# EAGLE board RBCX (EAGLE 9.6.2), part 1 of 3
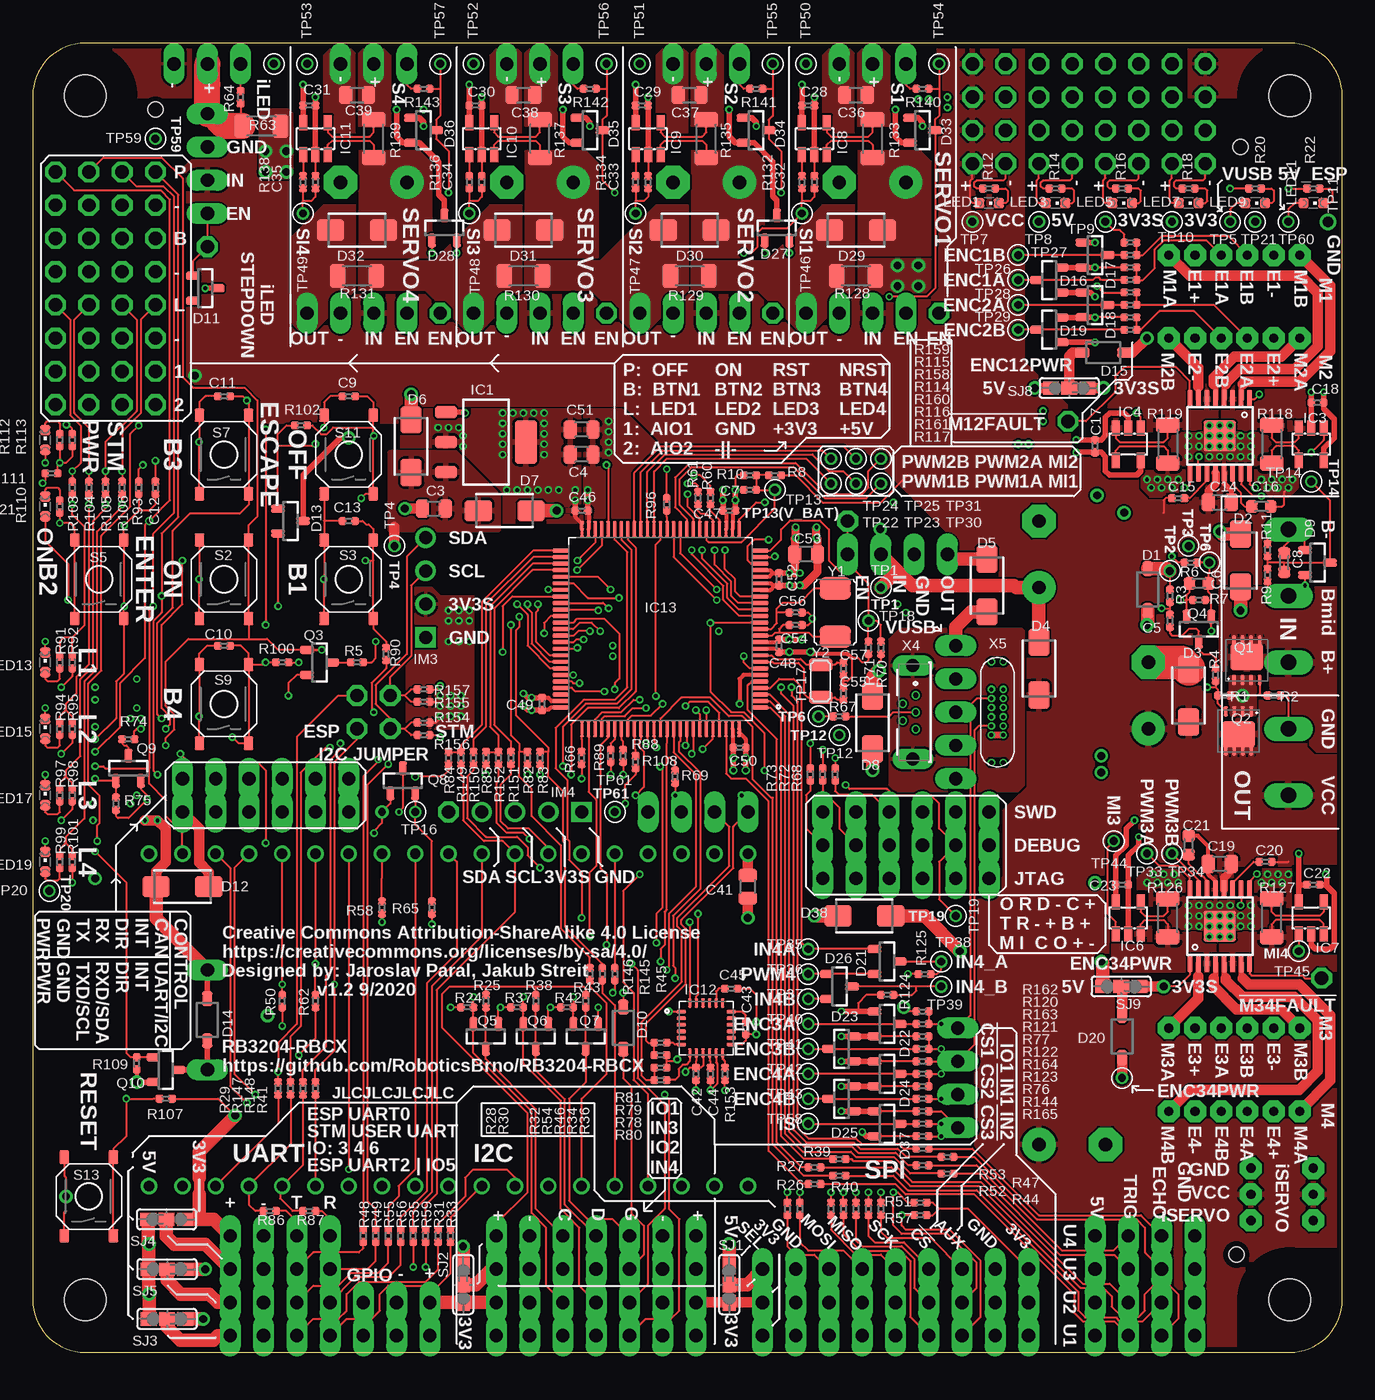
[diagram p14: board, top side]
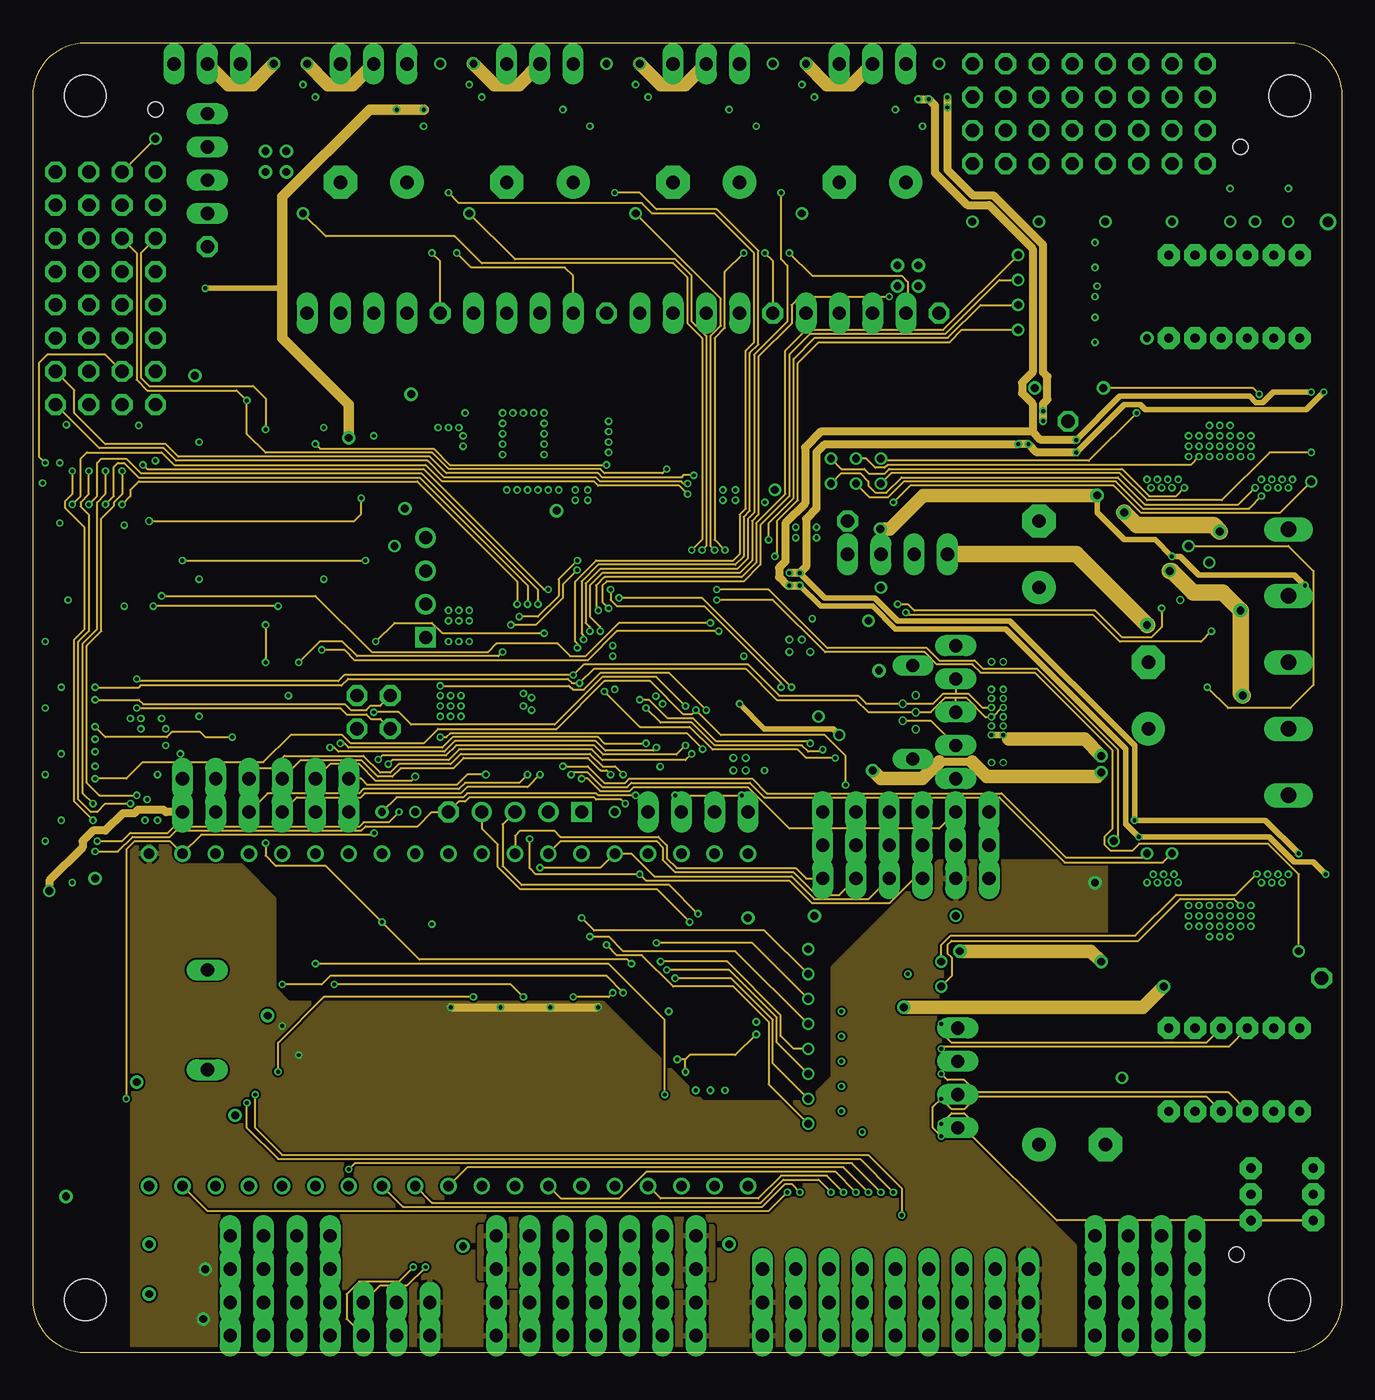
[diagram p15: board, inner layer Layer2-Sig]
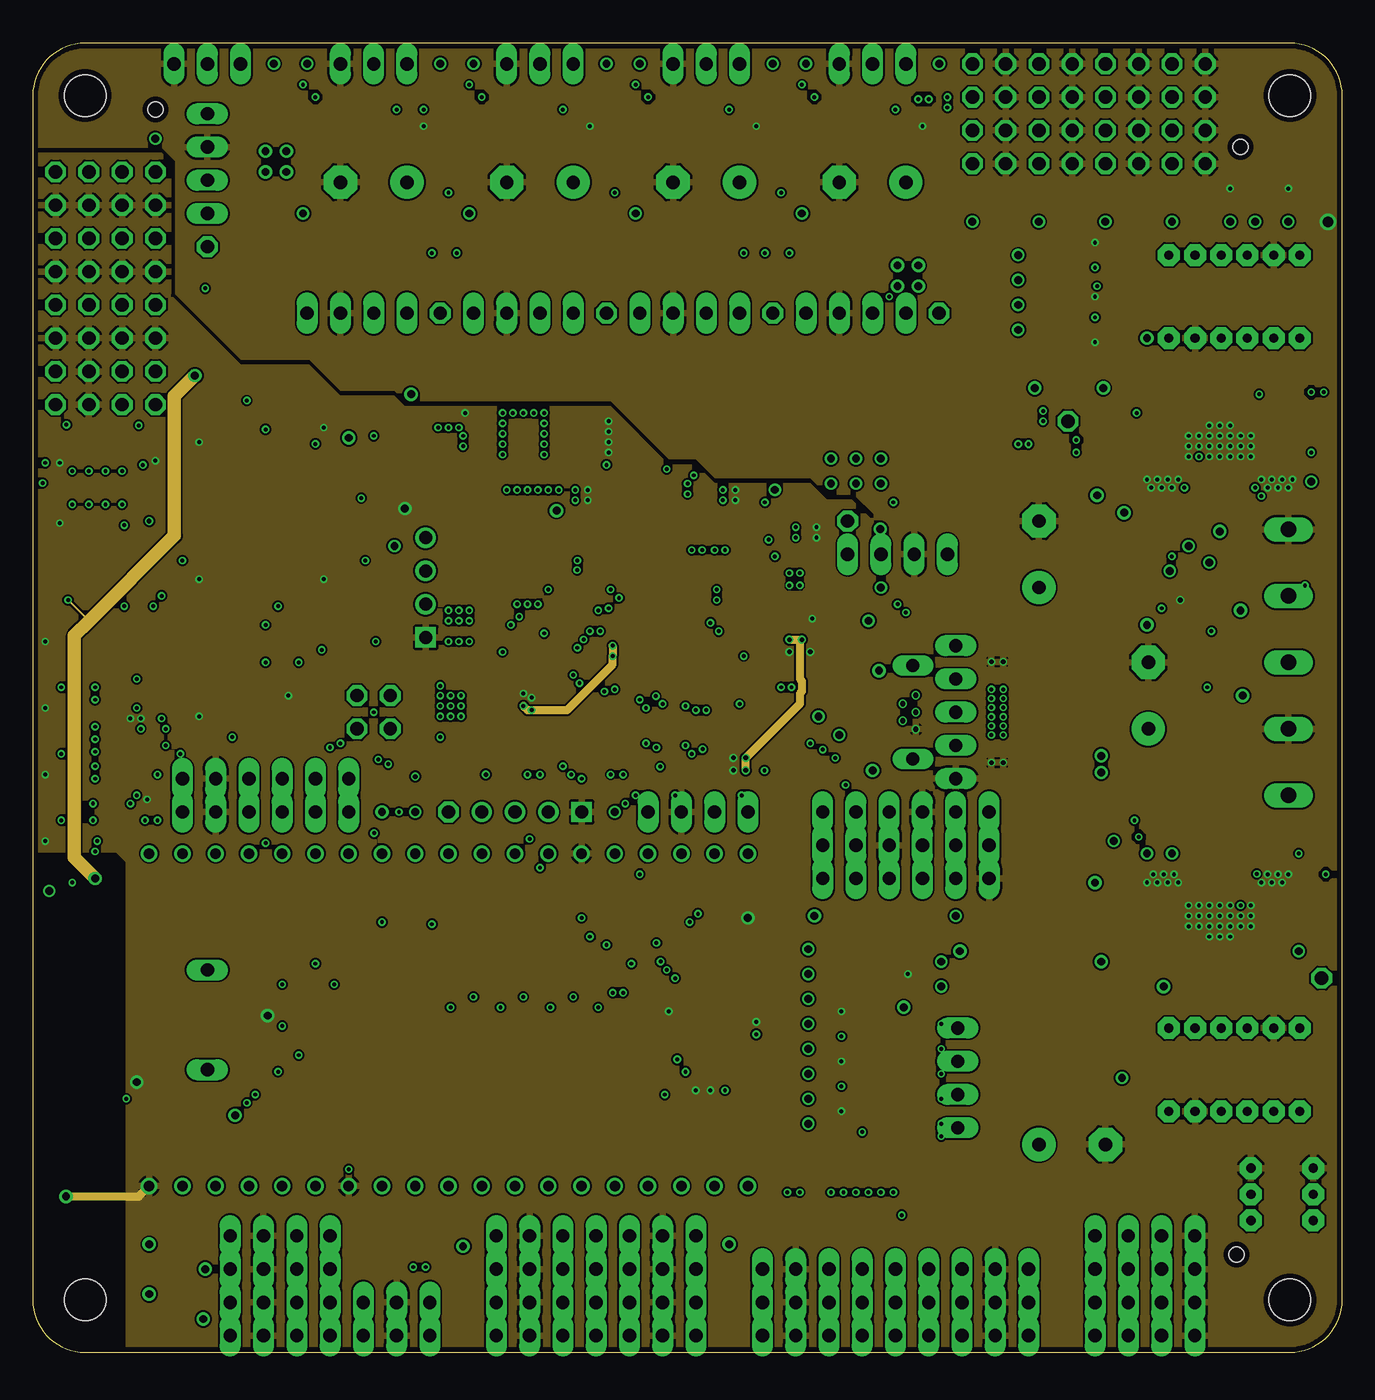
[diagram p16: board, inner layer Layer3-GND]
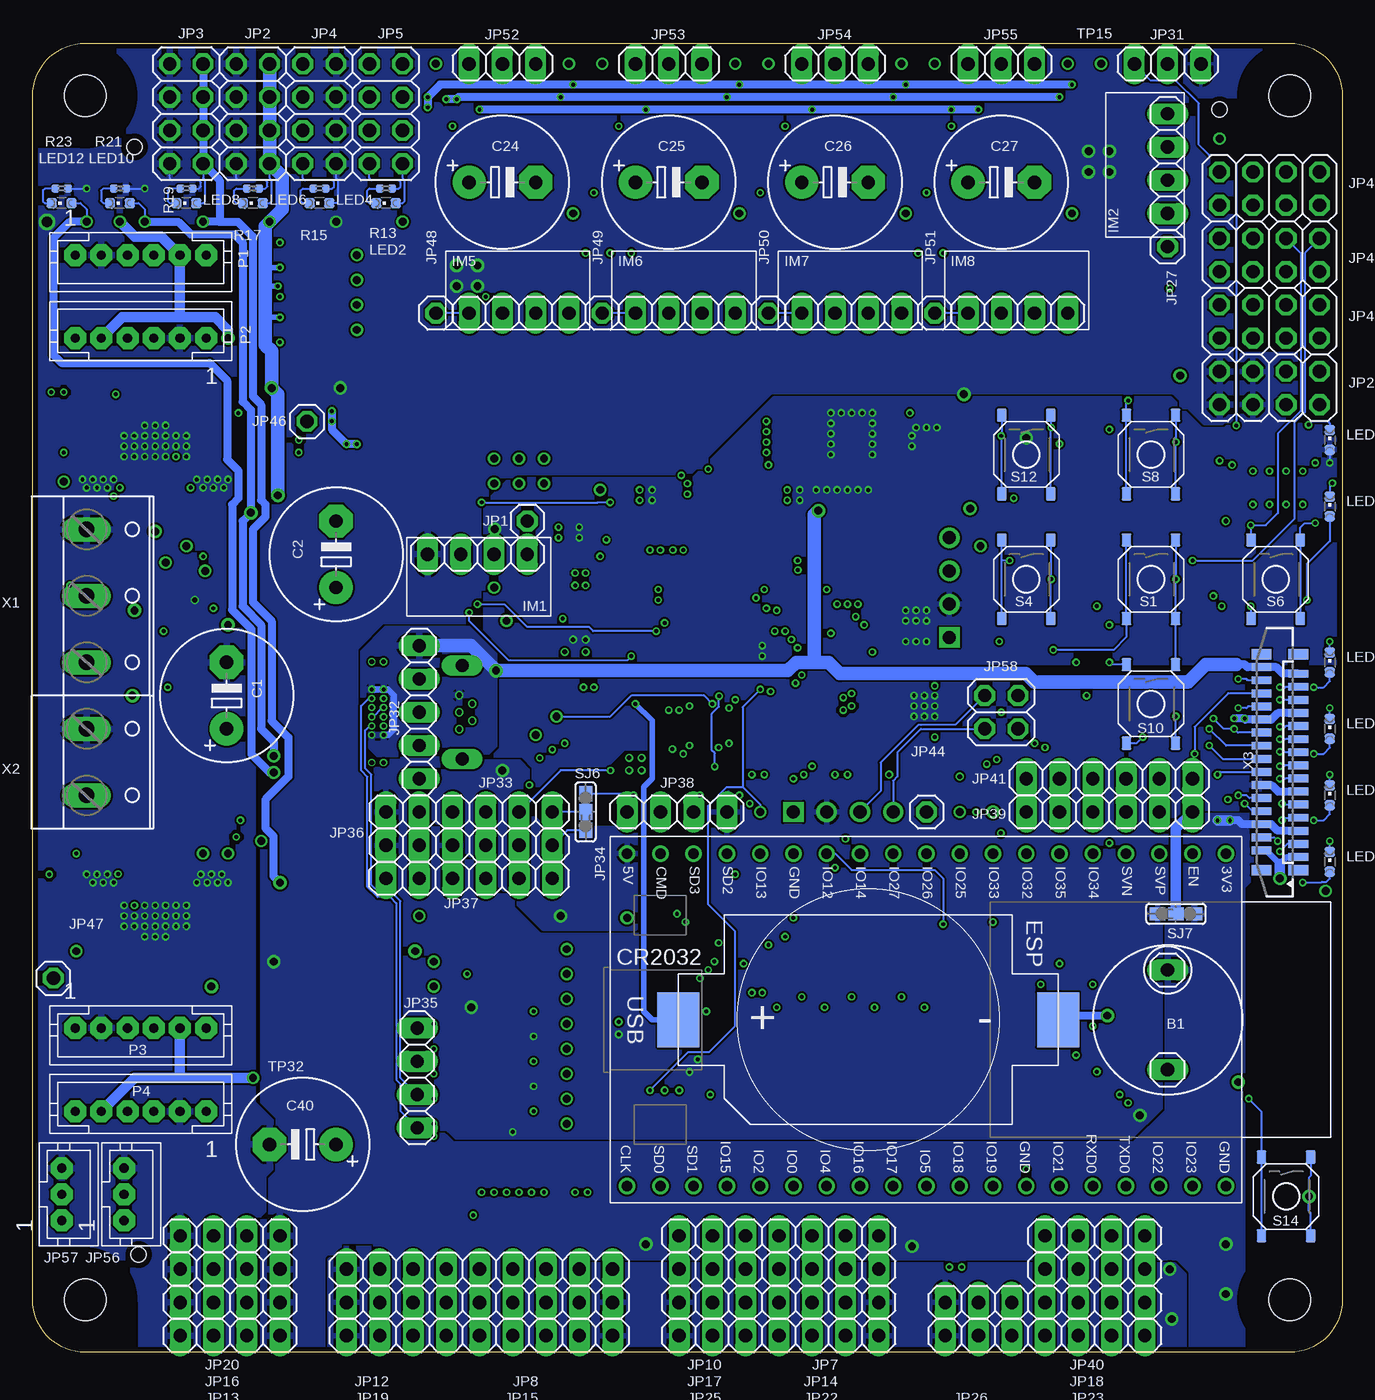
[diagram p17: board, bottom side, seen from below]

Size 100 x 100 mm. Coordinates in mm from the lower left corner, seen from the top.
Outline: 4,0 96,0 arc90 100,4 100,96 arc90 96,100 4,100 arc90 0,96 0,4 arc90 4,0
Copper layers (1+2*15+16): Top 0.035mm / dielectric 0.13mm / Layer2-Sig 0.018mm / dielectric 1.2mm / Layer3-GND 0.018mm / dielectric 0.13mm / Bottom 0.035mm
Design rules "robotikabrno-4-layers *": minimum track width 0.15mm, minimum drill 0.3mm, track to track 0.15mm, track to pad 0.15mm, pad to pad 0.15mm, via to via 0.15mm, smd to smd 0mil, copper to edge 0.4mm, drill to drill 0.35mm, minimum pad ring 3mil, minimum via ring 0.13mm, stop-mask expansion 0.1mm, vias tented up to drill 0.4mm, thermal gap 0.2mm
Net classes: 0 default: width 0.15 mm, drill 0.3 mm, clearance 0.15 mm
Holes 3.2 mm at 4,96 96,96 96,4 4,4
Holes 1.15 mm at 92.23,92.08 9.37,94.93 91.92,7.46
tRestrict: area 0,92 to 8,100; area 92,92 to 100,100; area 92,0 to 100,8; area 0,0 to 8,8; area 8.4,93.9 to 10.4,95.9; area 91.2,91.1 to 93.2,93.1; area 90.9,6.5 to 92.9,8.5; 13 lines
bRestrict: area 92,92 to 100,100; area 0,0 to 8,8; area 0,92 to 8,100; area 92,0 to 100,8; area 90.9,6.5 to 92.9,8.5; area 8.4,93.9 to 10.4,95.9; area 91.2,91.1 to 93.2,93.1; 3 lines

## Footprints (pad centres in the part's own frame; a part is rotated, then mirrored left to right if it is on the bottom)
PIEZO = drill 1.016 long: + 1.27,8.89; - 1.27,1.27
SMD-BAT-CR2032-BS-6-1 = smd 3.2 x 4.2: VBAT 14.5,0; VSS -14.5,0
E5-10,5 = drill 1.016 pad 2.54: + -2.54,0 | drill 1.016 pad 2.54 octagon: - 2.54,0
C0805 = smd 1.03 x 1.42: 1 -0.87,0; 2 0.87,0
C0402 = smd 0.6 x 0.58: 1 -0.465,0; 2 0.465,0
C0603 = smd 0.89 x 0.93: 1 -0.72,0; 2 0.72,0
SOD123 = smd 1.15 x 0.8: A 1.61,0; C -1.61,0
SMA = smd 2.08 x 1.62: A 2.015,0; C -2.015,0
SOT23 = smd 1.05 x 0.61: 1 0.96,-0.95; 2 0.96,0.95; 3 -0.96,0
SOT223 = smd 1.69 x 0.99: 1 3.055,-2.29; 2 3.055,0; 3 3.055,2.29 | smd 1.69 x 3.3: 4 -3.055,0
HTSSOP = smd 0.39 x 1.37: 1 -2.275,-2.82; 2 -1.625,-2.82; 3 -0.975,-2.82; 4 -0.325,-2.82; 5 0.325,-2.82; 6 0.975,-2.82; 7 1.625,-2.82; 8 2.275,-2.82; 9 2.275,2.82; 10 1.625,2.82; 11 0.975,2.82; 12 0.325,2.82; 13 -0.325,2.82; 14 -0.975,2.82; 15 -1.625,2.82; 16 -2.275,2.82 | smd 2.46 x 2.31: GND 0,0
SOT23-5L = smd 1.16 x 0.61: 1 1.23,-0.95; 2 1.23,0; 3 1.23,0.95; 4 -1.23,0.95; 5 -1.23,-0.95
QFN50P400X400X95-24N = smd 0.26 x 0.71: 1 -1.25,-1.91; 2 -0.75,-1.91; 3 -0.25,-1.91; 4 0.25,-1.91; 5 0.75,-1.91; 6 1.25,-1.91; 13 1.25,1.91; 14 0.75,1.91; 15 0.25,1.91; 16 -0.25,1.91; 17 -0.75,1.91; 18 -1.25,1.91 | smd 0.71 x 0.26: 7 1.91,-1.25; 8 1.91,-0.75; 9 1.91,-0.25; 10 1.91,0.25; 11 1.91,0.75; 12 1.91,1.25; 19 -1.91,1.25; 20 -1.91,0.75; 21 -1.91,0.25; 22 -1.91,-0.25; 23 -1.91,-0.75; 24 -1.91,-1.25
QFP50P1600X1600X160-100N_STM32F103VCT6 = smd 0.3 x 1.26: 1 -6,-7.63; 2 -5.5,-7.63; 3 -5,-7.63; 4 -4.5,-7.63; 5 -4,-7.63; 6 -3.5,-7.63; 7 -3,-7.63; 8 -2.5,-7.63; 9 -2,-7.63; 10 -1.5,-7.63; 11 -1,-7.63; 12 -0.5,-7.63; 13 0,-7.63; 14 0.5,-7.63; 15 1,-7.63; 16 1.5,-7.63; 17 2,-7.63; 18 2.5,-7.63; 19 3,-7.63; 20 3.5,-7.63; 21 4,-7.63; 22 4.5,-7.63; 23 5,-7.63; 24 5.5,-7.63; 25 6,-7.63; 51 6,7.63; 52 5.5,7.63; 53 5,7.63; 54 4.5,7.63; 55 4,7.63; 56 3.5,7.63; 57 3,7.63; 58 2.5,7.63; 59 2,7.63; 60 1.5,7.63; 61 1,7.63; 62 0.5,7.63; 63 0,7.63; 64 -0.5,7.63; 65 -1,7.63; 66 -1.5,7.63; 67 -2,7.63; 68 -2.5,7.63; 69 -3,7.63; 70 -3.5,7.63; 71 -4,7.63; 72 -4.5,7.63; 73 -5,7.63; 74 -5.5,7.63; 75 -6,7.63 | smd 1.26 x 0.3: 26 7.63,-6; 27 7.63,-5.5; 28 7.63,-5; 29 7.63,-4.5; 30 7.63,-4; 31 7.63,-3.5; 32 7.63,-3; 33 7.63,-2.5; 34 7.63,-2; 35 7.63,-1.5; 36 7.63,-1; 37 7.63,-0.5; 38 7.63,0; 39 7.63,0.5; 40 7.63,1; 41 7.63,1.5; 42 7.63,2; 43 7.63,2.5; 44 7.63,3; 45 7.63,3.5; 46 7.63,4; 47 7.63,4.5; 48 7.63,5; 49 7.63,5.5; 50 7.63,6; 76 -7.63,6; 77 -7.63,5.5; 78 -7.63,5; 79 -7.63,4.5; 80 -7.63,4; 81 -7.63,3.5; 82 -7.63,3; 83 -7.63,2.5; 84 -7.63,2; 85 -7.63,1.5; 86 -7.63,1; 87 -7.63,0.5; 88 -7.63,0; 89 -7.63,-0.5; 90 -7.63,-1; 91 -7.63,-1.5; 92 -7.63,-2; 93 -7.63,-2.5; 94 -7.63,-3; 95 -7.63,-3.5; 96 -7.63,-4; 97 -7.63,-4.5; 98 -7.63,-5; 99 -7.63,-5.5; 100 -7.63,-6
STEPDOWN = drill 1.016 long: EN 1.27,8.89; GND 1.27,3.81; IN 1.27,6.35; OUT 1.27,1.27
DISPLAY-OLED-128X64-I2C_W-HOLES = drill 1 square: 1 -3.81,12.7 | drill 1: 2 -1.27,12.7; 3 1.27,12.7; 4 3.81,12.7
DISPLAY-OLED-128X32 = drill 1 square: 1 -17.78,-3.81 | drill 1: 2 -17.78,-1.27; 3 -17.78,1.27; 4 -17.78,3.81
DEVKITC = drill 0.8: 1 -12.7,46.99; 2 -12.7,44.45; 3 -12.7,41.91; 4 -12.7,39.37; 5 -12.7,36.83; 6 -12.7,34.29; 7 -12.7,31.75; 8 -12.7,29.21; 9 -12.7,26.67; 10 -12.7,24.13; 11 -12.7,21.59; 12 -12.7,19.05; 13 -12.7,16.51; 14 -12.7,13.97; 15 -12.7,11.43; 16 -12.7,8.89; 17 -12.7,6.35; 18 -12.7,3.81; 19 -12.7,1.27; 20 12.7,1.27; 21 12.7,3.81; 22 12.7,6.35; 23 12.7,8.89; 24 12.7,11.43; 25 12.7,13.97; 26 12.7,16.51; 27 12.7,19.05; 28 12.7,21.59; 29 12.7,24.13; 30 12.7,26.67; 31 12.7,29.21; 32 12.7,31.75; 33 12.7,34.29; 34 12.7,36.83; 35 12.7,39.37; 36 12.7,41.91; 37 12.7,44.45; 38 12.7,46.99
1X01 = drill 1.016 octagon: 1 0,0
2X04 = drill 1.016 octagon: 1 -3.81,-1.27; 2 -3.81,1.27; 3 -1.27,-1.27; 4 -1.27,1.27; 5 1.27,-1.27; 6 1.27,1.27; 7 3.81,-1.27; 8 3.81,1.27
1X04 = drill 1.016 long: 1 -3.81,0; 2 -1.27,0; 3 1.27,0; 4 3.81,0
1X06 = drill 1.016 long: 1 -6.35,0; 2 -3.81,0; 3 -1.27,0; 4 1.27,0; 5 3.81,0; 6 6.35,0
1X03 = drill 1.016 long: 1 -2.54,0; 2 0,0; 3 2.54,0
1X05 = drill 1.016 long: 1 -5.08,0; 2 -2.54,0; 3 0,0; 4 2.54,0; 5 5.08,0
1X02 = drill 1.016 long: 1 -1.27,0; 2 1.27,0
JST-PH3 = drill 0.7 pad 1.676 octagon: 1 2,0; 2 0,0; 3 -2,0
2X02 = drill 1.016 octagon: 1 -1.27,-1.27; 2 -1.27,1.27; 3 1.27,-1.27; 4 1.27,1.27
CHIPLED_0603 = smd 0.8 x 0.8: A 0.75,0; C -0.75,0
JST-PH6 = drill 0.7 pad 1.676 octagon: 1 5,0; 2 3,0; 3 1,0; 4 -1,0; 5 -3,0; 6 -5,0
MLP3.3X3.3_HS = smd 0.76 x 0.32: 1 -1.495,0.975; 2 -1.495,0.325; 3 -1.495,-0.325; 4 -1.495,-0.975; 5 1.495,-0.975; 6 1.495,-0.325; 7 1.495,0.325; 8 1.495,0.975 | smd 2 x 2.5: 9 0.25,0
R0402 = smd 0.6 x 0.58: 1 -0.465,0; 2 0.465,0
R1206 = smd 1.2 x 1.82: 1 -1.46,0; 2 1.46,0
TS-1187A = smd 1 x 0.75: A -3,1.875; B 3,1.875; C -3,-1.875; D 3,-1.875
SJ_2_DEFAULT = smd 1.2 x 1: 1 -0.7,0; 2 0.7,0; 3 2.1,0
SJ_2_0603 = smd 1.2 x 1: 1 -1.4,0; 2 0,0; 3 1.4,0
TP_06 = drill 0.6: P$1 0,0
TP_08 = drill 0.8: P$1 0,0
W237-133 = drill 1.194 long: 1 -5.08,-0.635; 2 0,-0.635; 3 5.08,-0.635
W237-132 = drill 1.194 long: 1 -2.54,-0.635; 2 2.54,-0.635
52559-3092 = smd 0.6 x 1.5: 1 -7.25,-1.4; 2 -6.75,1.4; 3 -6.25,-1.4; 4 -5.75,1.4; 5 -5.25,-1.4; 6 -4.75,1.4; 7 -4.25,-1.4; 8 -3.75,1.4; 9 -3.25,-1.4; 10 -2.75,1.4; 11 -2.25,-1.4; 12 -1.75,1.4; 13 -1.25,-1.4; 14 -0.75,1.4; 15 -0.25,-1.4; 16 0.25,1.4; 17 0.75,-1.4; 18 1.25,1.4; 19 1.75,-1.4; 20 2.25,1.4; 21 2.75,-1.4; 22 3.25,1.4; 23 3.75,-1.4; 24 4.25,1.4; 25 4.75,-1.4; 26 5.25,1.4; 27 5.75,-1.4; 28 6.25,1.4; 29 6.75,-1.4; 30 7.25,1.4 | smd 0.8 x 1.5: M1 -8.25,-1.4; M2 8.25,-1.4; M3 8.25,1.4; M4 -8.25,1.4
614105150621 = drill 0.4: 1 -1.3,0.125; 2 -0.65,-0.875; 3 0,0.125; 4 0.65,-0.875; 5 1.3,0.125 | drill 1 pad 1.4 long: S1 -3.575,-0.095; S2 3.575,-0.095
USB_C_VERT_THT_8PIN = drill 0.35 pad 0.55: A1 -3.85,0.45; A12 3.85,0.45; B1 3.85,-0.45; B12 -3.85,-0.45 | drill 0.3 pad 0.55: A4 -1.75,0.45; A5 -1.05,0.45; A6 -0.35,0.45; A7 0.35,0.45; A8 1.05,0.45; A9 1.75,0.45; B4 1.75,-0.45; B5 1.05,-0.45; B6 0.35,-0.45; B7 -0.35,-0.45; B8 -1.05,-0.45; B9 -1.75,-0.45
OSCCC500X320X135 = smd 1.7 x 2.4: 1 -1.85,0; 2 1.85,0
SMD-3215_2P = smd 1 x 1.8: 1 -1.25,0; 2 1.25,0

## Placement (x,y rotation side)
B1  PIEZO  [PIEZO]  14.61,20.32 0 bottom
BAT1  CR2032  [SMD-BAT-CR2032-BS-6-1]  36.2,25.4 180 bottom
C1  220u  [E5-10,5]  85.19,50.16 90 bottom
C2  220u  [E5-10,5]  76.83,60.96 90 bottom
C3  10u  [C0805]  30.64,64.45 0 top
C4  10u  [C0805]  41.91,68.58 180 top
C5  100n  [C0402]  86.84,55.88 90 top
C6  2u2  [C0603]  89.06,58.74 180 top
C7  1u  [C0402]  54.77,65.88 180 top
C8  2u2  [C0603]  95.57,60.33 90 top
C9  1u  [C0402]  24.13,73.03 180 top
C10  1u  [C0402]  14.61,53.98 180 top
C11  1u  [C0402]  14.61,73.03 180 top
C12  1u  [C0402]  9.37,66.04 90 top
C13  1u  [C0402]  24.13,63.5 180 top
C14  10u  [C0805]  90.65,64.93 0 top
C15  10n  [C0402]  87.47,65.25 0 top
C16  2u2  [C0603]  93.82,64.61 0 top
C17  100n  [C0402]  81.12,69.22 90 top
C18  100n  [C0402]  98.11,72.55 180 top
C19  10u  [C0805]  90.65,37.31 180 top
C20  10n  [C0402]  94.14,37.47 180 top
C21  2u2  [C0603]  88.27,38.73 90 top
C22  100n  [C0402]  97.79,35.72 0 top
C23  100n  [C0402]  83.19,35.72 0 top
C24  220u  [E5-10,5]  64.14,89.38 0 bottom
C25  220u  [E5-10,5]  51.44,89.38 0 bottom
C26  220u  [E5-10,5]  38.73,89.38 0 bottom
C27  220u  [E5-10,5]  26.04,89.38 0 bottom
C28  100n  [C0402]  59.21,95.25 0 top
C29  100n  [C0402]  46.51,95.25 0 top
C30  100n  [C0402]  33.81,95.25 0 top
C31  100n  [C0402]  21.11,95.25 0 top
C32  1u  [C0402]  59.69,89.38 90 top
C33  1u  [C0402]  46.99,89.38 90 top
C34  1u  [C0402]  34.29,89.38 90 top
C35  1u  [C0402]  21.59,89.38 90 top
C36  10u  [C0805]  62.87,96.04 0 top
C37  10u  [C0805]  50.16,96.04 0 top
C38  10u  [C0805]  37.47,96.04 0 top
C39  10u  [C0805]  24.77,96.04 0 top
C40  220u  [E5-10,5]  79.38,15.88 180 bottom
C41  10u  [C0805]  54.61,35.56 90 top
C42  10n  [C0402]  50.64,21.27 270 top
C43  100n  [C0402]  54.45,24.77 270 top
C44  100n  [C0402]  51.75,21.27 90 top
C45  2n2  [C0402]  53.34,27.78 180 top
C46  100n  [C0402]  41.91,64.29 180 top
C47  100n  [C0402]  53.18,64.29 180 top
C48  100n  [C0402]  56.99,53.98 90 top
C49  100n  [C0402]  38.89,49.53 270 top
C50  100n  [C0402]  53.98,46.2 0 top
C51  10u  [C0805]  41.91,70.48 180 top
C52  100n  [C0402]  56.99,59.05 90 top
C53  10u  [C0805]  59.05,60.96 180 top
C54  18p  [C0402]  58.26,55.56 180 top
C55  6.8p  [C0402]  61.91,50.32 270 top
C56  18p  [C0402]  58.26,56.52 180 top
C57  6.8p  [C0402]  61.91,52.23 90 top
D1  B5819W  [SOD123]  85.16,58.26 270 top
D2  SS34  [SMA]  92.23,60.48 90 top
D3  SS34  [SMA]  88.27,50.16 90 top
D4  SS34  [SMA]  76.83,52.23 270 top
D5  SS34  [SMA]  72.87,58.58 270 top
D6  SS34  [SMA]  28.89,69.22 90 top
D7  SS34  [SMA]  36.04,64.29 0 top
D8  SS34  [SMA]  64.14,48.1 90 top
D9  BAS40-04  [SOT23]  98.11,60.33 180 top
D10  B5819W  [SOD123]  45.09,24.77 90 top
D11  BAS40-05  [SOT23]  13.18,81.28 180 top
D12  SS34  [SMA]  11.43,35.56 0 top
D13  BAS40-05  [SOT23]  19.68,63.5 180 top
D14  B5819W  [SOD123]  13.34,25.4 270 top
D15  B5819W  [SOD123]  81.76,76.36 180 top
D16  BAS40-04  [SOT23]  77.63,81.92 0 top
D17  BAS40-04  [SOT23]  81.12,83.82 180 top
D18  BAS40-04  [SOT23]  81.12,80.01 180 top
D19  BAS40-04  [SOT23]  77.63,78.11 0 top
D20  B5819W  [SOD123]  83.19,24.13 90 top
D21  BAS40-05  [SOT23]  65.25,29.84 180 top
D22  BAS40-04  [SOT23]  65.25,25.08 180 top
D23  BAS40-04  [SOT23]  61.75,23.18 0 top
D24  BAS40-04  [SOT23]  65.25,21.27 180 top
D25  BAS40-04  [SOT23]  61.75,19.37 0 top
D26  BAS40-05  [SOT23]  61.59,27.94 180 top
D27  BAS40-05  [SOT23]  56.83,85.88 270 top
D28  BAS40-05  [SOT23]  31.43,85.88 270 top
D29  SS34  [SMA]  62.87,85.72 180 top
D30  SS34  [SMA]  50.16,85.72 180 top
D31  SS34  [SMA]  37.47,85.72 180 top
D32  SS34  [SMA]  24.77,85.72 180 top
D33  BAS40-04  [SOT23]  67.94,93.34 180 top
D34  BAS40-04  [SOT23]  55.24,93.34 180 top
D35  BAS40-04  [SOT23]  42.55,93.34 180 top
D36  BAS40-04  [SOT23]  29.84,93.34 180 top
D37  BAS40-04  [SOT23]  65.25,17.46 180 top
D38  SS34  [SMA]  63.5,33.34 0 top
IC1  AMS1117-3.3  [SOT223]  34.61,69.53 180 top
IC2  DRV8833PWP  [HTSSOP]  90.65,70.01 180 top
IC3  INA180A4  [SOT23-5L]  97.63,69.37 90 top
IC4  INA180A4  [SOT23-5L]  83.66,69.37 90 top
IC5  DRV8833PWP  [HTSSOP]  90.65,32.54 0 top
IC6  INA180A4  [SOT23-5L]  83.66,33.18 270 top
IC7  INA180A4  [SOT23-5L]  97.63,33.18 270 top
IC8  INA180A4  [SOT23-5L]  59.69,92.71 270 top
IC9  INA180A4  [SOT23-5L]  46.99,92.71 270 top
IC10  INA180A4  [SOT23-5L]  34.29,92.71 270 top
IC11  INA180A4  [SOT23-5L]  21.59,92.71 270 top
IC12  MPU-6050  [QFN50P400X400X95-24N]  51.44,24.77 270 top
IC13  STM32F103VCT6  [QFP50P1600X1600X160-100N_STM32F103VCT6]  47.94,55.24 90 top
IM1  STEPDOWN  [STEPDOWN]  71.12,62.23 270 bottom
IM2  STEPDOWN  [STEPDOWN]  12.06,95.89 180 bottom
IM3  DISPLAY-OLED-128X64-I2C-W_HOLES  [DISPLAY-OLED-128X64-I2C_W-HOLES]  42.7,58.42 90 top
IM4  DISPLAY-OLED-128X32  [DISPLAY-OLED-128X32]  38.1,59.05 90 top
IM5  STEPDOWN  [STEPDOWN]  57.78,78.11 90 bottom
IM6  STEPDOWN  [STEPDOWN]  45.09,78.11 90 bottom
IM7  STEPDOWN  [STEPDOWN]  32.38,78.11 90 bottom
IM8  STEPDOWN  [STEPDOWN]  19.68,78.11 90 bottom
IM9  DEVKITC  [DEVKITC]  55.88,25.4 270 bottom
JP1  3V3_EN  [1X01]  62.23,63.5 0 bottom
JP2  +3V3STM  [2X04]  83.19,94.61 90 bottom
JP3  +3V3  [2X04]  88.27,94.61 90 bottom
JP4  +5V  [2X04]  78.11,94.61 90 bottom
JP5  VCC  [2X04]  73.03,94.61 90 bottom
JP6  UTS1  [1X04]  84.93,1.27 180 bottom
JP7  ESP_I2C1_VSEL  [1X04]  39.21,8.89 180 bottom
JP8  ESP_SPI1  [1X06]  62.07,6.35 180 bottom
JP9  ESP_UART  [1X04]  18.89,1.27 180 bottom
JP10  ESP_I2C_AUX1_VSEL  [1X03]  48.1,8.89 180 bottom
JP11  ESP_UART_AUX  [1X03]  27.78,1.27 180 bottom
JP12  ESP_SPI_AUX1  [1X03]  73.5,6.35 180 bottom
JP13  UTS2  [1X04]  84.93,3.81 180 bottom
JP14  ESP_I2C2_VSEL  [1X04]  39.21,6.35 180 bottom
JP15  ESP_SPI2  [1X06]  62.07,3.81 180 bottom
JP16  UTS3  [1X04]  84.93,6.35 180 bottom
JP17  ESP_I2C_AUX2_VSEL  [1X03]  48.1,6.35 180 bottom
JP18  STM_UART  [1X04]  18.89,6.35 180 bottom
JP19  ESP_SPI_AUX2  [1X03]  73.5,3.81 180 bottom
JP20  UTS4  [1X04]  84.93,8.89 180 bottom
JP21  ESP_SPI3  [1X06]  62.07,1.27 180 bottom
JP22  ESP_I2C1  [1X04]  39.21,3.81 180 bottom
JP23  ESP_UCOM  [1X04]  18.89,3.81 180 bottom
JP24  ESP_SPI_AUX3  [1X03]  73.5,1.27 180 bottom
JP25  ESP_I2C_AUX1  [1X03]  48.1,3.81 180 bottom
JP26  ESP_UCOM_AUX  [1X03]  27.78,3.81 180 bottom
JP27  ILED_EN  [1X01]  13.34,84.45 90 bottom
JP28  ESP_I2C2  [1X04]  39.21,1.27 180 bottom
JP29  AIO  [2X04]  5.56,73.66 180 bottom
JP30  ESP_I2C_AUX2  [1X03]  48.1,1.27 180 bottom
JP31  ILED  [1X03]  13.34,98.42 0 bottom
JP32  USB  [1X05]  70.48,48.9 270 bottom
JP33  SWD  [1X06]  66.67,41.27 0 bottom
JP34  DEBUG  [1X04]  64.14,38.73 0 bottom
JP35  USBC_AUX  [1X04]  70.64,20.95 270 bottom
JP36  BOOT_SW  [1X02]  71.75,38.73 0 bottom
JP37  ESP32_JTAG  [1X06]  66.67,36.2 180 bottom
JP38  MPU_I2C  [1X04]  50.8,41.27 180 bottom
JP39  EXPANDER_UART  [1X06]  17.78,41.27 180 bottom
JP40  ESP_PROG_UART  [1X04]  18.89,8.89 180 bottom
JP41  EXPANDER_CAN/I2C  [1X06]  17.78,43.81 180 bottom
JP42  LEDS  [2X04]  5.56,78.74 180 bottom
JP43  BUTTONS  [2X04]  5.56,83.82 180 bottom
JP44  BUZZER  [1X01]  31.75,41.27 0 bottom
JP45  PWR_BUTTONS  [2X04]  5.56,88.9 180 bottom
JP46  M12FAULT  [1X01]  79.06,71.12 90 bottom
JP47  M34FAULT  [1X01]  98.42,28.57 90 bottom
JP48  SERVO1_EN  [1X01]  69.22,79.38 270 bottom
JP49  SERVO2_EN  [1X01]  56.52,79.38 270 bottom
JP50  SERVO3_EN  [1X01]  43.81,79.38 270 bottom
JP51  SERVO4_EN  [1X01]  31.11,79.38 270 bottom
JP52  SERVO1  [1X03]  64.14,98.42 0 bottom
JP53  SERVO2  [1X03]  51.44,98.42 0 bottom
JP54  SERVO3  [1X03]  38.73,98.42 0 bottom
JP55  SERVO4  [1X03]  26.04,98.42 0 bottom
JP56  INTELIGENT_SERVO1  [JST-PH3]  93.03,12.06 270 bottom
JP57  INTELIGENT_SERVO2  [JST-PH3]  97.79,12.06 270 bottom
JP58  I2C_INTERCONNECT  [2X02]  26.04,48.9 90 bottom
LED1  red  [CHIPLED_0603]  73.03,87.79 180 top
LED2  red  [CHIPLED_0603]  73.03,87.79 0 bottom
LED3  red  [CHIPLED_0603]  78.11,87.79 180 top
LED4  red  [CHIPLED_0603]  78.11,87.79 0 bottom
LED5  red  [CHIPLED_0603]  83.19,87.79 180 top
LED6  red  [CHIPLED_0603]  83.19,87.79 0 bottom
LED7  red  [CHIPLED_0603]  88.27,87.79 180 top
LED8  red  [CHIPLED_0603]  88.27,87.79 0 bottom
LED9  red  [CHIPLED_0603]  93.34,87.79 180 top
LED10  red  [CHIPLED_0603]  93.34,87.79 0 bottom
LED11  red  [CHIPLED_0603]  97.79,87.79 180 top
LED12  red  [CHIPLED_0603]  97.79,87.79 0 bottom
LED13  green  [CHIPLED_0603]  0.95,52.7 270 top
LED14  green  [CHIPLED_0603]  0.95,52.7 270 bottom
LED15  yellow  [CHIPLED_0603]  0.95,47.62 270 top
LED16  yellow  [CHIPLED_0603]  0.95,47.62 270 bottom
LED17  red  [CHIPLED_0603]  0.95,42.55 270 top
LED18  red  [CHIPLED_0603]  0.95,42.55 270 bottom
LED19  blue  [CHIPLED_0603]  0.95,37.47 270 top
LED20  blue  [CHIPLED_0603]  0.95,37.47 270 bottom
LED21  red  [CHIPLED_0603]  0.95,64.61 270 top
LED22  red  [CHIPLED_0603]  0.95,64.61 270 bottom
LED23  red  [CHIPLED_0603]  0.95,69.69 270 top
LED24  red  [CHIPLED_0603]  0.95,69.69 270 bottom
P1  M1  [JST-PH6]  91.76,83.82 180 bottom
P2  M2  [JST-PH6]  91.76,77.47 0 bottom
P3  M3  [JST-PH6]  91.76,24.77 180 bottom
P4  M4  [JST-PH6]  91.76,18.41 0 bottom
Q1  NCE20P45Q  [MLP3.3X3.3_HS]  92.71,52.86 90 top
Q2  NCE20P45Q  [MLP3.3X3.3_HS]  92.08,47.47 270 top
Q3  2N7002  [SOT23]  21.91,52.7 180 top
Q4  2N7002  [SOT23]  89.06,55.24 90 top
Q5  2N7002  [SOT23]  34.61,24.13 90 top
Q6  2N7002  [SOT23]  38.42,24.13 90 top
Q7  2N7002  [SOT23]  42.23,24.13 90 top
Q8  2N7002  [SOT23]  28.26,43.66 270 top
Q9  2N7002  [SOT23]  7.3,44.61 270 top
Q10  2N7002  [SOT23]  10.16,21.59 180 top
R1  100k  [R0402]  90.96,50.16 180 top
R2  10k  [R0402]  94.77,50.16 180 top
R3  24k  [R0402]  86.84,57.78 90 top
R4  10k  [R0402]  90.33,51.75 270 top
R5  330R  [R0402]  24.77,52.7 180 top
R6  10k  [R0402]  88.42,60.33 180 top
R7  1M  [R0402]  89.06,57.47 0 top
R8  24k  [R0402]  56.67,66.99 0 top
R9  5k6  [R0402]  94.3,59.37 270 top
R10  10k  [R0402]  54.77,66.99 0 top
R11  10k  [R0402]  94.3,61.28 270 top
R12  4k7  [R0402]  73.03,88.9 0 top
R13  4k7  [R0402]  73.03,88.9 180 bottom
R14  2k2  [R0402]  78.11,88.9 0 top
R15  2k2  [R0402]  78.11,88.9 180 bottom
R16  1k  [R0402]  83.19,88.9 0 top
R17  1k  [R0402]  83.19,88.9 180 bottom
R18  1k  [R0402]  88.27,88.9 0 top
R19  1k  [R0402]  88.27,88.9 180 bottom
R20  2k2  [R0402]  93.34,88.9 0 top
R21  2k2  [R0402]  93.34,88.9 180 bottom
R22  2k2  [R0402]  97.79,88.9 0 top
R23  2k2  [R0402]  97.79,88.9 180 bottom
R24  4k7  [R0402]  33.18,26.35 180 top
R25  4k7  [R0402]  34.61,26.83 90 top
R26  330R  [R0402]  59.69,12.86 0 top
R27  330R  [R0402]  59.69,14.13 0 top
R28  330R  [R0402]  57.63,10.95 270 top
R29  330R  [R0402]  18.73,20.16 90 top
R30  330R  [R0402]  58.58,10.95 270 top
R31  330R  [R0402]  30.96,8.89 270 top
R32  330R  [R0402]  60.96,10.95 270 top
R33  330R  [R0402]  31.91,8.89 270 top
R34  330R  [R0402]  63.82,10.95 270 top
R35  330R  [R0402]  29.05,8.89 270 top
R36  330R  [R0402]  64.77,10.95 270 top
R37  4k7  [R0402]  36.99,26.35 180 top
R38  4k7  [R0402]  38.42,26.83 90 top
R39  330R  [R0402]  61.59,14.76 0 top
R40  330R  [R0402]  61.59,13.49 0 top
R41  330R  [R0402]  21.59,20.16 90 top
R42  4k7  [R0402]  40.8,26.35 180 top
R43  4k7  [R0402]  42.23,26.83 90 top
R44  330R  [R0402]  69.85,13.65 0 top
R45  330R  [R0402]  44.45,28.89 270 top
R46  330R  [R0402]  62.87,10.95 270 top
R47  330R  [R0402]  69.85,14.92 0 top
R48  330R  [R0402]  25.24,8.89 270 top
R49  330R  [R0402]  26.19,8.89 270 top
R50  4k7  [R0402]  19.05,26.83 90 top
R51  100k  [R0402]  67.79,11.43 180 top
R52  330R  [R0402]  67.94,14.29 0 top
R53  330R  [R0402]  67.94,15.56 0 top
R54  330R  [R0402]  61.91,10.95 270 top
R55  330R  [R0402]  27.15,8.89 270 top
R56  330R  [R0402]  28.1,8.89 270 top
R57  100k  [R0402]  67.79,10.48 180 top
R58  330R  [R0402]  26.67,33.97 270 top
R59  330R  [R0402]  30,8.89 270 top
R60  330R  [R0402]  51.75,65.25 90 top
R61  330R  [R0402]  50.8,65.25 270 top
R62  4k7  [R0402]  21.59,26.83 90 top
R63  0R  [R1206]  17.46,93.66 0 top
R64  4k7  [R0402]  15.88,95.89 270 top
R65  330R  [R0402]  30.48,33.97 90 top
R66  330R  [R0402]  41.91,45.4 270 top
R67  1k5  [R0402]  61.59,48.58 0 top
R68  330R  [R0402]  61.28,44.13 270 top
R69  330R  [R0402]  49.05,43.97 270 top
R70  5k6  [R0402]  64.77,53.82 270 top
R71  10k  [R0402]  63.82,53.82 90 top
R72  330R  [R0402]  60.33,44.13 270 top
R73  330R  [R0402]  59.37,44.13 270 top
R74  330R  [R0402]  7.3,46.83 0 top
R75  100k  [R0402]  6.35,41.91 270 top
R76  5k1  [R0402]  67.94,18.41 180 top
R77  5k1  [R0402]  67.94,22.23 180 top
R78  4k7  [R0402]  47.94,21.75 0 top
R79  4k7  [R0402]  47.94,22.7 0 top
R80  330R  [R0402]  47.94,20.8 0 top
R81  330R  [R0402]  47.94,23.65 0 top
R82  330R  [R0402]  37.78,45.4 270 top
R83  330R  [R0402]  38.73,45.4 270 top
R84  330R  [R0402]  31.75,45.4 270 top
R85  330R  [R0402]  34.61,45.4 270 top
R86  330R  [R0402]  18.1,10.79 0 top
R87  330R  [R0402]  21.11,10.79 0 top
R88  330R  [R0402]  45.09,45.56 270 top
R89  330R  [R0402]  44.13,45.56 270 top
R90  330R  [R0402]  26.99,53.34 90 top
R91  330R  [R0402]  2.06,52.7 270 top
R92  330R  [R0402]  3.02,52.7 270 top
R93  330R  [R0402]  8.1,66.04 270 top
R94  330R  [R0402]  2.06,47.62 270 top
R95  330R  [R0402]  3.02,47.62 270 top
R96  330R  [R0402]  48.42,64.77 90 top
R97  330R  [R0402]  2.06,42.55 270 top
R98  330R  [R0402]  3.02,42.55 270 top
R99  330R  [R0402]  2.06,37.47 270 top
R100  330R  [R0402]  19.05,52.7 180 top
R101  330R  [R0402]  3.02,37.47 270 top
R102  2k2  [R0402]  20.48,70.8 0 top
R103  330R  [R0402]  3.02,66.04 90 top
R104  330R  [R0402]  4.29,66.04 90 top
R105  330R  [R0402]  5.56,66.04 90 top
R106  330R  [R0402]  6.83,66.04 90 top
R107  1M  [R0402]  10.16,19.37 0 top
R108  330R  [R0402]  46.04,45.09 270 top
R109  1M  [R0402]  7.94,22.07 270 top
R110  4k7  [R0402]  2.06,64.61 90 top
R111  4k7  [R0402]  1.43,67.15 180 top
R112  1k  [R0402]  2.06,69.69 90 top
R113  1k  [R0402]  3.02,69.69 90 top
R114  2k2  [R0402]  83.82,81.92 0 top
R115  2k2  [R0402]  83.82,83.82 0 top
R116  2k2  [R0402]  83.82,80.01 0 top
R117  2k2  [R0402]  83.82,78.11 0 top
R118  5m  [R1206]  94.61,69.37 90 top
R119  5m  [R1206]  86.68,69.37 90 top
R120  2k2  [R0402]  67.94,25.08 0 top
R121  2k2  [R0402]  67.94,23.18 0 top
R122  2k2  [R0402]  67.94,21.27 0 top
R123  2k2  [R0402]  67.94,19.37 0 top
R124  10k  [R0402]  65.25,27.3 0 top
R125  10k  [R0402]  68.1,28.89 0 top
R126  5m  [R1206]  86.68,33.18 270 top
R127  5m  [R1206]  94.61,33.18 270 top
R128  0R  [R1206]  62.87,82.23 180 top
R129  0R  [R1206]  50.16,82.23 180 top
R130  0R  [R1206]  37.47,82.23 180 top
R131  0R  [R1206]  24.77,82.23 180 top
R132  1k  [R0402]  58.74,89.38 90 top
R133  5m  [R1206]  64.14,92.71 270 top
R134  1k  [R0402]  46.04,89.38 90 top
R135  5m  [R1206]  51.44,92.71 270 top
R136  1k  [R0402]  33.34,89.38 90 top
R137  5m  [R1206]  38.73,92.71 270 top
R138  1k  [R0402]  20.64,89.38 90 top
R139  5m  [R1206]  26.04,92.71 270 top
R140  2k2  [R0402]  67.94,96.52 180 top
R141  2k2  [R0402]  55.24,96.52 180 top
R142  2k2  [R0402]  42.55,96.52 180 top
R143  2k2  [R0402]  29.84,96.52 180 top
R144  2k2  [R0402]  67.94,17.46 0 top
R145  330R  [R0402]  43.5,28.89 90 top
R146  330R  [R0402]  42.55,28.89 90 top
R147  330R  [R0402]  19.68,20.16 90 top
R148  330R  [R0402]  20.64,20.16 90 top
R149  330R  [R0402]  32.7,45.4 90 top
R150  330R  [R0402]  33.66,45.4 90 top
R151  330R  [R0402]  36.51,45.4 90 top
R152  330R  [R0402]  35.56,45.4 90 top
R153  330R  [R0402]  52.86,21.27 90 top
R154  4k7  [R0402]  29.84,48.1 0 top
R155  4k7  [R0402]  29.84,49.69 0 top
R156  330R  [R0402]  29.84,47.15 180 top
R157  330R  [R0402]  29.84,50.64 180 top
R158  15K  [R0402]  83.82,82.87 0 top
R159  15K  [R0402]  83.82,84.77 180 top
R160  15K  [R0402]  83.82,80.96 0 top
R161  15K  [R0402]  83.82,79.06 180 top
R162  15K  [R0402]  67.94,26.04 0 top
R163  15K  [R0402]  67.94,24.13 180 top
R164  15K  [R0402]  67.94,20.32 0 top
R165  15K  [R0402]  67.94,16.51 180 top
S1  TS-1187A-C-C-B  [TS-1187A]  14.61,59.05 270 bottom
S2  TS-1187A-C-C-B  [TS-1187A]  14.61,59.05 90 top
S3  TS-1187A-C-C-B  [TS-1187A]  24.13,59.05 90 top
S4  TS-1187A-C-C-B  [TS-1187A]  24.13,59.05 270 bottom
S5  TS-1187A-C-C-B  [TS-1187A]  5.08,59.05 90 top
S6  TS-1187A-C-C-B  [TS-1187A]  5.08,59.05 270 bottom
S7  TS-1187A-C-C-B  [TS-1187A]  14.61,68.58 90 top
S8  TS-1187A-C-C-B  [TS-1187A]  14.61,68.58 270 bottom
S9  TS-1187A-C-C-B  [TS-1187A]  14.61,49.53 90 top
S10  TS-1187A-C-C-B  [TS-1187A]  14.61,49.53 270 bottom
S11  TS-1187A-C-C-B  [TS-1187A]  24.13,68.58 90 top
S12  TS-1187A-C-C-B  [TS-1187A]  24.13,68.58 270 bottom
S13  TS-1187A-C-C-B  [TS-1187A]  4.29,11.91 90 top
S14  TS-1187A-C-C-B  [TS-1187A]  4.29,11.91 270 bottom
SJ1  [SJ_2_DEFAULT]  53.18,5.87 270 top
SJ2  [SJ_2_DEFAULT]  32.86,5.87 270 top
SJ3  [SJ_2_DEFAULT]  10.95,2.54 180 top
SJ4  [SJ_2_DEFAULT]  9.53,10.16 0 top
SJ5  [SJ_2_DEFAULT]  10.95,6.35 180 top
SJ6  [SJ_2_0603]  57.78,41.27 90 bottom
SJ7  [SJ_2_0603]  12.7,33.5 0 bottom
SJ8  [SJ_2_DEFAULT]  79.85,73.66 180 top
SJ9  [SJ_2_DEFAULT]  83.82,27.94 180 top
TP1  [TP_06]  64.77,58.42 270 top
TP2  [TP_06]  86.84,59.69 270 top
TP3  [TP_06]  88.27,61.59 270 top
TP4  [TP_06]  27.62,61.59 90 top
TP5  [TP_06]  91.44,86.36 0 top
TP6  [TP_06]  89.85,60.33 270 top
TP7  [TP_06]  71.75,86.36 0 top
TP8  [TP_06]  76.83,86.36 0 top
TP9  [TP_06]  81.92,86.36 0 top
TP10  [TP_06]  87,86.36 0 top
TP11  [TP_08]  98.9,86.36 0 top
TP12  [TP_06]  61.59,47.15 270 top
TP13  [TP_06]  56.67,65.88 270 top
TP14  [TP_06]  97.63,66.52 270 top
TP15  [TP_06]  18.41,98.42 270 bottom
TP16  [TP_06]  29.21,41.27 0 top
TP17  [TP_06]  60.01,48.58 180 top
TP18  [TP_06]  63.82,55.88 180 top
TP19  [TP_06]  70.48,33.34 0 top
TP20  [TP_06]  1.27,35.24 0 top
TP21  [TP_06]  93.34,86.36 270 top
TP22  [TP_06]  60.96,66.36 0 top
TP23  [TP_06]  62.87,66.36 0 top
TP24  [TP_06]  60.96,68.26 0 top
TP25  [TP_06]  62.87,68.26 0 top
TP26  [TP_06]  75.25,81.92 270 top
TP27  [TP_06]  75.25,83.82 270 top
TP28  [TP_06]  75.25,80.01 270 top
TP29  [TP_06]  75.25,78.11 270 top
TP30  [TP_06]  64.77,66.36 0 top
TP31  [TP_06]  64.77,68.26 0 top
TP32  [TP_06]  83.19,20.95 270 bottom
TP33  [TP_06]  85.09,38.1 270 top
TP34  [TP_06]  87,38.1 270 top
TP35  [TP_06]  59.21,30.8 270 top
TP36  [TP_06]  59.21,28.89 270 top
TP37  [TP_06]  59.21,26.99 270 top
TP38  [TP_06]  69.37,29.84 270 top
TP39  [TP_06]  69.37,27.94 270 top
TP40  [TP_06]  59.21,25.08 270 top
TP41  [TP_06]  59.21,23.18 270 top
TP42  [TP_06]  59.21,21.27 270 top
TP43  [TP_06]  59.21,19.37 270 top
TP44  [TP_06]  82.55,39.05 270 top
TP45  [TP_06]  96.68,30.64 270 top
TP46  [TP_06]  58.74,87 90 top
TP47  [TP_06]  46.04,87 90 top
TP48  [TP_06]  33.34,87 90 top
TP49  [TP_06]  20.64,87 90 top
TP50  [TP_06]  59.05,98.42 90 top
TP51  [TP_06]  46.35,98.42 90 top
TP52  [TP_06]  33.66,98.42 90 top
TP53  [TP_06]  20.95,98.42 90 top
TP54  [TP_06]  69.22,98.42 90 top
TP55  [TP_06]  56.52,98.42 90 top
TP56  [TP_06]  43.81,98.42 90 top
TP57  [TP_06]  31.11,98.42 90 top
TP58  [TP_06]  59.21,17.46 270 top
TP59  [TP_06]  9.37,92.71 0 top
TP60  [TP_06]  95.89,86.36 0 top
TP61  [TP_06]  44.45,41.27 0 top
X1  POWER_IN  [W237-133]  95.25,57.78 270 bottom
X2  POWER_OUT  [W237-132]  95.25,45.09 270 bottom
X3  52559-3092  [52559-3092]  4.76,45.09 90 bottom
X4  uUSB  [614105150621]  67.31,48.9 270 top
X5  [USB_C_VERT_THT_8PIN]  73.66,48.9 90 top
Y1  5032/2P  [OSCCC500X320X135]  61.28,56.52 270 top
Y2  3215_2P  [SMD-3215_2P]  60.17,51.28 270 top

## Tracks (layer width: path | path; a pad name or v marks a point on that pad's centre or on a via)
3V3_EN
  Top 0.152: IM1.EN JP1.1
3V3_IN
  Top 0.813: TP4.P$1 27.62,63.02
  pour Top (rank 2): 27.3,68.74 32.23,68.74 35.56,65.41 35.56,62.87 27.3,62.87
5V_IN
  Top 1.016: D4.C C2.+ 75.09,58.42 74.93,58.58 67.15,58.58 66.04,59.69 | 66.04,59.69 IM1.IN | TP1.P$1 66.04,59.69
!M12_FAULT
  Top 0.152: IC2.8 88.37,74.19 87.31,75.25 83.34,75.25 82.65,74.56 82.65,73.36 80.42,71.12 JP46.1
!M34_FAULT
  Top 0.152: IC5.8 92.92,28.93 93.07,28.78 96.95,28.78 97.16,28.57 JP47.1
+3V3  (via drill 0.3, 0.6)
  Top 0.152: R24.2 v31.91,26.35 | R37.2 v35.72,26.35 35.56,26.19 Q5.1 | Q6.1 39.37,26.19 v39.53,26.35 R42.2 | Q7.1 v43.18,26.35 | LED8.A 87,87.79 86.84,87.95 86.84,89.53 87,89.69 JP3.1 | JP12.3 71.44,10.95 69.22,10.95 | 69.22,10.95 68.74,11.43 R51.1 | R57.1 68.74,10.48 69.22,10.95 | R50.1 v19.05,24.92 | R62.1 21.59,23.98 20.32,22.71 v20.32,22.7
  Top 0.813: JP25.3 53.17,3.81 | 53.19,3.81 JP15.1
  Top 1.016: SJ5.1 v13.18,6.35 | SJ3.1 v13.02,2.54 | JP26.3 32.74,3.81 | SJ1.3 53.18,3.8 53.19,3.81 | SJ2.3 32.9,3.81 JP22.1
  Layer2-Sig 0.61: v31.91,26.35 v35.72,26.35 v39.53,26.35 v43.18,26.35
  Bottom 0.152: LED8.A 87,87.79 86.84,87.95 86.84,89.53 87,89.69 JP3.1
  Bottom 0.61: JP3.7 JP3.5 JP3.3 JP3.1 85.72,89.53 85.72,86.36 | 85.72,86.36 TP10.P$1 | 85.72,86.36 84.33,86.36 83.2,85.22 83.2,73.04 82.55,72.39 82.55,65.09 82.23,64.77 82.23,63.82 83.19,62.87 83.19,57.31 81.76,55.88 81.76,48.24 80.49,46.97 80.49,43.97 82.23,42.23 82.23,40.04 81.63,39.44 81.63,36.38 v81.12,35.88
  pour Bottom (rank 2): 77.31,0 77.31,6.99 76.36,7.94 73.18,7.94 71.91,6.67 12.86,6.67 12.06,5.87 12.06,0
  pour Layer2-Sig (rank 3): 7.62,39.37 7.62,0 79.53,0 79.53,8.1 69.37,18.26 69.37,29.53 71.75,31.91 81.92,31.91 81.92,37.47 69.22,37.47 61.12,29.37 61.12,20.95 59.21,19.05 51.12,19.05 43.5,26.67 19.53,26.67 18.41,27.78 18.41,34.61 15.88,37.15 11.75,37.15 9.53,39.37
+3V3S  (via drill 0.3, 0.3 pad 0.6, 0.35, 0.6)
  Top 0.152: R78.2 48.41,22.23 | 48.41,22.23 R79.2 | v49.21,22.38 49.05,22.23 48.41,22.23 | v55.24,24.29 v55.23,24.3 C43.2 54.45,23.81 54.15,23.52 IC12.13 | IC12.8 50.69,22.27 50.64,22.23 C42.1 | IC12.9 51.19,21.9 51.03,21.74 C42.1 | C42.1 50.15,21.74 v49.85,21.43 | LED6.A 81.92,87.79 81.76,87.95 81.76,89.53 81.92,89.69 JP2.1 | LED24.A v0.95,67.94 | IC2.1 93.31,72.83 v93.66,73.18 | IC5.1 88.37,28.84 87.47,27.94 v86.36,27.94 | R6.2 87.47,60.33 v87,60.8 | D9.2 97.16,59.37 v97.16,58.58 | R154.2 30.8,48.1 31.11,48.42 v31.11,48.58 | R155.2 30.8,49.69 v31.11,49.37 | R107.2 14.16,19.37 15.46,18.07 | R159.2 83.36,85.4 83.03,85.72 82.55,85.72 TP9.P$1 | R161.2 v81.12,79.06 | R158.1 v81.12,82.87 | v81.28,81.44 81.76,80.96 R160.1 | R162.1 66.83,26.04 v66.52,26.35 | R163.2 D22.2 | R164.1 D24.2 | R165.2 D37.2
  Top 0.305: IC13.100 53.94,47.34 54.44,46.84 C50.2 | IC13.50 41.94,63.31 41.45,63.81 C46.2 | C47.2 52.94,64.07 IC13.28 | IC13.11 56.8,54.24 C48.2 | 54.44,45.41 v54.45,45.4 | C28.1 | C29.1 | C30.1 | C31.1 | IC13.22 56.3,59.74 56.53,59.52 | 56.53,59.52 C52.2 | IC13.21 56.25,59.24 56.53,59.52 | IC13.75 39.56,49.24 39.38,49.06 C49.2
  Top 0.406: C48.2 v57.78,54.44 v58.74,54.44 | C50.2 54.44,45.41 | IC8.5 C28.1 | C28.1 58.75,96.83 v58.74,96.84 | D33.2 66.36,92.39 65.88,92.87 v65.88,94.93 | IC9.5 C29.1 | C29.1 46.05,96.83 v46.04,96.84 | v53.18,94.93 53.18,92.87 53.66,92.39 D34.2 55.08,92.39 56.52,90.96 56.52,88.32 56.83,88 D27.3 | IC10.5 C30.1 | C30.1 33.35,96.83 v33.34,96.84 | D35.2 40.95,92.39 40.48,92.87 v40.48,94.93 | IC11.5 C31.1 | C31.1 20.65,96.83 v20.64,96.84 | v27.78,94.93 27.78,92.87 28.25,92.39 D36.2 29.52,92.39 31.01,90.91 31.01,88.43 31.43,88 D28.3 | D16.2 D17.2 v81.12,82.87 | D19.2 D18.2 v81.12,79.06 | v79.69,68.74 79.7,68.75 C17.1 81.59,68.75 81.92,68.42 81.92,67.31 82.23,66.99 84.3,66.99 84.61,67.31 IC4.5 | IC3.5 98.58,69.05 99.38,69.85 99.38,71.28 98.57,72.08 C18.1 v98.57,73.33 v98.58,73.34 | D37.2 63.66,16.51 v63.34,16.83 | IC7.5 96.68,35.72 | C22.1 96.68,35.72 | 96.68,35.72 v96.68,38.1 | IC6.5 C23.1 82.72,37.94 83.51,38.73 83.51,40.02 v84.14,40.64 | C52.2 v57.77,59.52 v57.78,59.53 | C47.2 52.72,65.08 v52.7,65.09 v52.7,65.88 | C46.2 41.43,64.31 v41.43,65.09 | C49.2 38.11,49.06 v38.1,49.05 37.78,49.05 v37.47,49.37 | v61.75,20.32 v61.76,20.32 D25.2 D24.2 | D22.2 D23.2 v61.76,24.13 v61.75,24.13 | v54.45,45.4 v54.45,44.45 | v24.13,69.85 23.5,69.85 20.64,67 D13.3 | D11.3 v13.18,81.28
  Top 0.61: v57.77,59.52 58.19,59.52 C53.2 58.19,62.15 v58.26,62.23 v58.26,63.02
  Top 0.813: SJ8.1 v81.76,73.66 | SJ9.1 v86.36,27.94 | 12.7,13.34 12.7,12.06 12.7,11.27
  Top 1.016: JP40.1 13.81,10.16 12.7,10.16 | v15.46,18.1 15.46,18.07 12.7,15.31 12.7,13.34 | 12.7,12.06 12.7,10.16 | SJ4.3 12.7,10.16
  Layer2-Sig 0.152: v55.24,24.29 53.66,22.7 50.16,22.7 49.85,22.38 | 49.85,22.38 v49.21,22.38 | v49.85,21.43 49.85,22.38 | JP29.5 5.56,76.2 1.11,76.2 0.48,75.56 0.48,68.42 v0.95,67.94 | v93.66,73.18 93.19,73.66 v81.76,73.66
  Layer2-Sig 0.406: v96.68,38.1 94.14,40.64 v84.14,40.64 84.14,46.35 74.61,55.88 66.04,55.88 64.29,57.63 60.48,57.63 v58.58,59.53 | v79.69,68.74 83.34,72.39 84.56,72.39 84.95,71.99 97.23,71.99 v98.58,73.34 | v81.28,65.46 81.28,64.14 83.34,62.07 85.72,62.07 v87,60.8 87.63,60.8 89.04,59.39 96.35,59.39 v97.16,58.58 | v13.18,81.28 19.05,81.28
  Layer2-Sig 0.61: v57.78,59.53 v58.58,59.53 59.05,60.01 59.05,63.66 59.85,64.45 59.85,68.74 60.48,69.37 v75.25,69.37 v76.04,69.37 76.68,68.74 v79.69,68.74 | v69.85,95.89 v69.85,95.09 69.85,90.33 71.79,88.39 73.34,88.39 77.15,84.58 77.15,74.87 77.48,74.54 77.48,72.78 77.15,72.45 v77.15,71.12
  Layer2-Sig 0.813: v24.13,69.85 24.13,72.39 19.05,77.47 19.05,81.28 19.05,88.27 25.72,94.93 v27.78,94.93 v29.84,94.93
  Layer2-Sig 1.016: v86.36,27.94 84.77,26.35 v66.52,26.35 | v81.28,65.46 68,65.46 65.43,62.89 v64.72,62.89
  Layer3-GND 0.61: v37.47,49.37 37.78,49.05 v38.1,49.05 40.8,49.05 44.29,52.55 v44.29,53.18 v44.29,53.98 | v54.45,44.45 v54.45,45.4 58.58,49.53 58.58,50.32 58.74,50.48 58.74,51.28 58.58,51.44 58.58,54.28 v58.74,54.44 v57.78,54.44
  Bottom 0.152: LED6.A 81.92,87.79 81.76,87.95 81.76,89.53 81.92,89.69 JP2.1 | LED24.A v0.95,67.94
  Bottom 0.406: v81.12,82.87 82.23,82.87 | v81.12,79.06 82.23,79.06 | v81.28,81.44 82.23,81.44
  Bottom 0.61: X3.12 5.39,43.34 4.89,42.84 X3.11 | v20.64,96.84 v33.34,96.84 v46.04,96.84 v58.74,96.84 68.9,96.84 v69.85,95.89 v69.85,95.09 | v27.78,94.93 v40.48,94.93 v53.18,94.93 v65.88,94.93 | v75.25,69.37 v76.04,69.37 77.15,70.48 v77.15,71.12 v77.15,71.91
  Bottom 1.016: JP2.7 JP2.5 JP2.3 JP2.1 80.96,89.85 80.96,87.31 TP9.P$1 82.23,86.04 82.23,82.87 82.23,81.44 82.23,79.06 82.23,76.94 81.76,76.46 v81.76,73.66 81.28,73.18 v81.28,65.46
  other vias: 41.43,65.88 36.67,71.75 37.47,71.75 38.26,71.75 39.05,71.75 39.05,70.96 39.05,70.17 39.05,69.37 35.88,71.75 35.88,70.17 35.88,70.96 32.86,69.22 32.86,70.01 32.54,70.64 31.75,70.64 30.96,70.64 40.16,65.88 38.58,65.88 39.37,65.88 36.99,65.88 36.2,65.88 39.05,68.58 37.78,65.88 35.88,68.58 35.88,69.37 31.75,56.67 32.54,56.67 33.34,56.67 33.34,55.88 32.54,55.88 31.75,55.88 31.75,54.29 32.54,54.29 33.34,54.29 32.7,50.16 32.7,49.37 32.7,48.58 31.91,48.58 31.91,49.37 31.91,50.16 31.11,50.16
  pour Top (rank 3): 28.26,63.5 28.26,71.91 41.91,71.91 41.91,63.5
  pour Bottom (rank 2): 13.18,72.87 10.79,70.48 8.89,70.48 7.62,71.75 7.62,76.2 0,76.2 0,52.7 65.41,52.7 65.41,64.77 63.5,66.67 49.53,66.67 43.34,72.87
  cutout Bottom (rank 2): 58.74,59.21 58.9,59.37 58.9,59.69 58.74,59.85 57.63,59.85 57.47,59.69 57.47,59.37 57.63,59.21
  pour Bottom (rank 5): 7.62,52.07 74.3,52.07 74.3,15.88 7.62,15.88 7.62,41.27 6.35,42.55 6.35,43.81 7.62,45.09
  pour Top: 28.57,58.42 30.48,58.42 31.11,57.78 33.66,57.78 33.66,47.62 28.57,47.62
  cutout Bottom: 37.02,49.21 37.31,48.9 37.62,48.9 37.94,48.58 38.26,48.58 38.58,48.9 38.58,49.21 38.26,49.53 37.94,49.53 37.62,49.85 37.34,49.85 36.99,49.53 36.99,49.24
  cutout Bottom: 53.18,45.88 53.18,43.97 55.88,43.97 55.88,44.77 54.77,45.88
+5V  (via drill 0.3, 0.6)
  Top 0.152: LED4.A 76.83,87.79 76.68,87.95 76.68,89.53 76.83,89.69 JP4.1
  Top 0.406: D14.C B1.+
  Top 0.813: D12.C 9.41,36.72 10.16,37.47 10.16,40.01 v9.53,40.64 v8.57,40.64 | SJ8.3 v76.52,73.66
  Top 1.016: D12.C 9.41,33.13 B1.+ | v28.89,73.18 D6.A | v32.86,8.1 SJ2.1 | SJ1.1 v53.18,8.26 | D38.A 68.1,33.34 v70.8,30.64 | D5.C 70.22,60.59 IM1.OUT | D1.A 85.16,55.63 v85.09,55.56 | SJ3.3 8.89,2.58 v8.89,4.45 8.85,4.41 SJ5.3 8.85,8.22 v8.89,8.26 8.82,8.32 SJ4.1 | v81.6,29.84 81.72,29.72 SJ9.3
  Layer2-Sig 1.016: v70.8,30.64 80.8,30.64 v81.6,29.84
  Layer2-Sig 1.27: IM1.OUT 79.69,60.96 v85.09,55.56
  Bottom 0.152: JP4.1 76.83,89.69 76.68,89.53 76.68,87.95 76.83,87.79 LED4.A
  Bottom 0.61: X3.5 4.91,39.84 5.41,40.34 X3.6 7.63,40.34 7.94,40.64 v8.57,40.64
  Bottom 0.813: v8.57,40.64 v9.53,40.64
  other vias: 66.04,83.03 66.04,81.44 67.63,83.03 67.63,81.44 19.37,91.76 17.78,91.76 19.37,90.17 17.78,90.17
  pour Bottom (rank 3): 6.99,40.96 11.11,40.96 13.34,38.73 13.34,18.41 15.88,15.88 67.94,15.88 69.22,17.14 69.22,23.02 72.07,25.88 72.07,33.97 74.77,36.67 74.77,47.15 68.92,53 57.95,53.18 40.64,70.48 9.21,70.48 8.26,71.44 8.26,100.33 82.39,100.33 82.39,0 7.62,0 7.62,35.56 6.99,36.2
  pour Top (rank 5, no thermals): 63.02,83.5 63.02,80.8 68.58,80.8 68.58,83.5
  pour Top (rank 3, no thermals): 19.84,94.61 19.53,94.93 17.62,94.93 17.3,94.61 17.3,90.01 17.62,89.69 19.53,89.69 19.84,90.01
  cutout Bottom (rank 3): 76.83,88.27 76.83,87.31 77.79,87.31 77.79,88.27
BAT+
  pour Top: 99.69,58.26 90.81,58.26 90.81,52.23 94.61,52.23 94.73,49.42 98.11,46.04 99.69,46.04
BAT+_PROTECTED  (via drill 0.6)
  Top 0.152: TP2.P$1 R3.2
  Top 1.016: D2.C v92.23,56.67 | D1.C 86.6,59.87 86.78,59.69 TP2.P$1
  Layer2-Sig 1.27: v92.39,50.16 92.23,50.32 v92.23,56.67 90.86,58.05 88.64,58.05 87,59.69 TP2.P$1
  pour Top (no thermals): 91.44,51.59 91.44,48.74 93.34,48.74 93.34,51.59
BAT_MID
  Top 0.152: R9.2 94.3,58.26 94.77,57.78 X1.2
BOOT0  (via drill 0.3)
  Top 0.152: v50.64,49.05 50.94,48.75 IC13.94 | v62.07,43.34 62.39,43.02 65.25,43.02 65.72,42.55 68.58,42.55 69.22,41.91 69.22,40.01 JP36.2 69.22,37.47 69.22,34.61 TP19.P$1 | R75.1 Q9.1 4.93,43.65 v4.76,43.81
  Layer2-Sig 0.152: v4.76,43.81 7.14,43.81 8.41,45.09 17.62,45.09 19.68,47.15 23.65,47.15 24.29,46.51 29.84,46.51 30.96,47.62 40.01,47.62 43.66,51.28 47.15,51.28 49.69,48.74 50.32,48.74 v50.64,49.05 52.55,47.15 60.48,47.15 62.07,45.56 v62.07,43.34
  Bottom 0.152: v4.76,43.81 4.33,43.81 4.32,43.84 X3.13
BOOT1_PULL-DOWN
  Top 0.152: R74.1 6.84,46.5 6.99,46.35 7.14,46.35 7.3,46.2 Q9.3
BUTTON1  (via drill 0.3)
  Top 0.152: R90.1 26.99,52.24 25.88,51.13 25.88,49.05 v26.04,48.9 | IC13.97 52.44,48.84 51.59,49.69 50.16,49.69 v49.85,49.37
  Layer2-Sig 0.152: v49.85,49.37 47.62,51.59 43.5,51.59 39.85,47.94 28.89,47.94 27.94,48.9 v26.04,48.9
BUTTON2  (via drill 0.3)
  Top 0.152: v8.41,67.79 8.41,67.78 8.1,67.46 R93.1 | IC13.57 39.39,58.24 v39.37,58.26
  Layer2-Sig 0.152: v8.41,67.79 8.73,67.47 29.84,67.47 39.05,58.26 v39.37,58.26
BUTTON3
  Top 0.152: IC13.37 48.44,63.79 48.42,63.82 R96.1
BUTTON4  (via drill 0.3)
  Top 0.152: R100.1 v20.32,52.7 | v35.88,53.5 35.88,56.99 36.63,57.74 IC13.58
  Layer2-Sig 0.152: v35.88,53.5 35.56,53.18 24.77,53.18 23.65,54.29 21.91,54.29 v20.32,52.7
BUTTON-1  (via drill 0.3)
  Top 0.152: 26,60.48 S4.D 26,55.27 26.99,54.29 R90.2 | 26,60.48 S4.C 26,62.9 25.66,63.24 25.45,63.24 25.2,63.5 C13.1 | v10.16,47.62 10.48,47.94 10.48,48.58 9.84,49.21 9.84,55.56 11.43,57.15 v11.43,60.48 | v25.4,60.48 26,60.48
  Layer2-Sig 0.152: v11.43,60.48 v25.4,60.48
  Bottom 0.152: X3.18 8.87,46.34 v10.16,47.62 | JP43.1 2.86,83.98 2.86,71.8 3.65,71.01 3.65,63.66 6.83,60.48 v11.43,60.48 | S4.D 26,60.48 | 26,60.48 S4.C | v25.4,60.48 26,60.48
BUTTON-2  (via drill 0.3)
  Top 0.152: v4.76,46.83 6.37,48.43 6.37,51.24 6.96,51.83 S6.D 6.96,57.02 | R93.2 8.1,64.29 | C12.1 9.37,64.77 8.89,64.29 8.1,64.29 | 8.1,64.29 v6.99,63.18 6.96,63.15 S6.C 6.96,57.02 | 6.96,57.02 v6.99,56.99
  Bottom 0.152: v4.76,46.83 4.32,46.83 4.32,46.84 X3.19 | JP43.3 3.17,83.98 3.17,71.91 4.92,70.17 4.92,64.09 5.83,63.18 v6.99,63.18 6.96,63.15 S6.C | S6.D 6.96,56.96 v6.99,56.99
BUTTON-3  (via drill 0.3)
  Top 0.152: v9.84,48.42 9.53,48.74 9.53,55.72 10.7,56.89 10.7,62.76 12,64.06 15.8,64.06 16.48,64.74 S8.D S8.C 16.48,72.58 v16.35,72.71 16.03,73.03 C11.1 | R96.2 v48.42,67.47 | R74.2 7.77,47.45 7.94,47.62 v8.26,47.62
  Layer2-Sig 0.152: JP43.5 7.94,83.98 7.94,74.3 8.75,73.48 15.58,73.48 v16.35,72.71 16.35,70.15 17.78,68.72 30.5,68.72 31.75,67.47 43.34,67.47 43.66,67.15 48.1,67.15 v48.42,67.47
  Bottom 0.152: S8.D S8.C 16.48,72.58 v16.35,72.71 | X3.20 7.96,47.34 v8.26,47.62 9.05,47.62 v9.84,48.42
BUTTON-4  (via drill 0.3)
  Top 0.152: S10.C S10.D 15.7,46.53 v15.24,46.99 | v17.78,70.5 v17.78,55.56 | S10.C 16.48,53.37 15.88,53.98 C10.1 | R100.2 v17.78,52.7 17.61,52.53 S10.C
  Layer2-Sig 0.152: v4.76,47.78 5.56,46.99 10.24,46.99 10.62,47.37 12.8,47.37 13.17,46.99 v15.24,46.99 | JP43.7 8.26,83.98 8.26,74.45 8.89,73.82 16.83,73.82 17.78,72.87 v17.78,70.5 | v17.78,55.56 v17.78,52.7
  Bottom 0.152: v4.76,47.78 4.37,47.78 4.32,47.84 X3.21 | S10.C 17.61,52.53 v17.78,52.7 | S10.D 15.7,46.53 v15.24,46.99
BUTTON-OFF  (via drill 0.3, 0.35)
  Top 0.152: v4.76,45.88 6.67,47.78 6.67,51.12 8.57,53.02 8.57,63.18 v8.89,63.5 10.48,65.09 10.48,88.06 9.78,88.76 3.16,88.76 JP45.1 | C9.1 25.56,73.03 26,72.58 S12.C 26,70.64 | v25.08,65.25 25.42,65.58 S12.D 26,69.98 v26.04,70.01 26,70.04 26,70.64 | R102.2 21.35,70.8 22.02,70.14 22.43,70.14 22.94,70.64 26,70.64
  Layer2-Sig 0.152: v8.89,63.5 24.56,63.5 25.08,64.02 v25.08,65.25
  Bottom 0.152: v4.76,45.88 4.36,45.88 4.32,45.84 X3.17 | S12.C 26,70.04 v26.04,70.01 26,69.98 S12.D
BUTTON-ON  (via drill 0.3)
  Top 0.152: v10.16,46.35 10.16,46.91 10.82,47.57 10.82,48.71 10.16,49.37 10.16,52.77 11.88,54.49 16.51,54.49 | JP45.3 5.39,91.28 9.84,91.28 11.45,89.67 11.45,74.49 12.26,73.67 16.18,73.67 17.14,72.71 17.14,63.86 16.48,63.19 S1.C S1.D 16.51,56.02 16.51,54.49 | 16.51,54.49 17.9,54.49 18.73,53.66 v22.07,53.66 Q3.1 | R3.1 86.84,56.83 | 86.84,56.83 C5.2 | v86.2,56.83 86.84,56.83
  Layer2-Sig 0.152: v52.39,55.09 44.61,55.09 42.39,52.86 24.61,52.86 23.81,53.66 v22.07,53.66 | v66.04,57.15 66.83,57.15 67.33,56.66 81.14,56.66 83.19,54.61 85.41,54.61 86.2,55.4 v86.2,56.83
  Bottom 0.152: v10.16,46.35 9.14,45.34 X3.16 | v52.39,55.09 57.2,55.09 57.52,55.4 62.23,55.4 63.98,57.15 v66.04,57.15 | S1.C S1.D 16.48,54.64 17.46,53.66 v22.07,53.66
BUTTON-ON-LV
  Top 0.152: Q3.3 R5.2
BUTTON_OFF  (via drill 0.3)
  Top 0.152: v43.81,67.79 43.94,67.66 IC13.46 | D13.1 18.73,69.22 | 18.73,69.22 18.73,70.16 19.37,70.8 R102.1 | v21.59,69.39 21.42,69.22 18.73,69.22
  Layer2-Sig 0.152: v21.59,69.39 21.95,69.03 30.62,69.03 31.86,67.79 v43.81,67.79
BUTTON_ON  (via drill 0.3)
  Top 0.152: R5.1 25.88,52.7 26.19,53.02 v26.19,54.29 | IC13.61 39.58,56.24 39.05,55.72 v39.05,54.93
  Layer2-Sig 0.152: v26.19,54.29 v26.2,54.29 27.63,55.72 30.48,55.72 31.27,54.93 v39.05,54.93
BUZZER
  Top 0.152: IC13.84 45.94,46.12 46.04,46.03 R108.1
BUZZER-
  Top 0.406: D14.A B1.- Q10.3
BUZZER-GATE  (via drill 0.3)
  Top 0.152: Q10.1 R109.1 7.47,22.53 7.14,22.86 7.14,35.88 v4.76,38.26 | R108.2 46.04,44.14 45.24,43.35 v45.24,41.91
  Layer2-Sig 0.152: v45.24,41.91 44.93,42.23 43.02,42.23 42.86,42.39 33.34,42.39 33.02,42.07 32.54,42.07 JP44.1 30.48,41.27 29.38,40.18 25.41,40.18 25.08,39.85 10.95,39.85 10.48,39.37 7.62,39.37 6.51,38.26 v4.76,38.26
  Bottom 0.152: X3.3 4.19,38.84 v4.76,38.26
CONTROL-DIR  (via drill 0.35)
  Top 0.152: R84.2 31.75,44.46 31.26,43.97 v29.21,43.97 | JP41.5 JP39.5
  Layer2-Sig 0.152: v29.21,43.97 28.89,43.66 26.19,43.66 24.92,44.93 22.7,44.93 JP41.5
CONTROL-INT  (via drill 0.35)
  Top 0.152: JP41.6 JP39.6 | v34.61,44.13 R85.2
  Layer2-Sig 0.152: v34.61,44.13 33.18,44.13 32.38,43.34 25.56,43.34 25.08,43.81 JP41.6
CONTROL-RX/SDA  (via drill 0.3)
  Top 0.152: R83.2 v38.73,44.13
  Layer2-Sig 0.152: v38.73,44.13 37.78,43.18 33.18,43.18 32.7,42.7 25.35,42.7 25.05,42.4 20.18,42.4 JP39.4
CONTROL-TX/SCL  (via drill 0.3)
  Top 0.152: R82.2 v37.78,44.13
  Layer2-Sig 0.152: v37.78,44.13 37.15,43.5 33.02,43.5 32.54,43.02 25.24,43.02 24.92,42.7 17.94,42.7 JP39.3
CONTROL_RX/SDA  (via drill 0.3)
  Top 0.152: IC13.48 42.94,61.84 v41.59,60.48 | v37.15,56.2 37.15,55.4 36.89,55.15 36.89,48.68 39.37,46.2 39.37,45.88 | 39.37,45.88 39.37,43.97 40.48,42.86 40.48,39.05 40.64,38.89 40.64,32.53 43.5,29.68 R145.2 | R83.1 38.75,45.88 39.37,45.88
  Layer2-Sig 0.152: v41.59,60.48 40.16,59.06 40.16,57.78 38.58,56.2 v37.15,56.2
CONTROL_TX/SCL  (via drill 0.3)
  Top 0.152: IC13.47 43.44,61.62 v41.57,59.75 | 37.15,45.88 37.15,46.51 36.51,47.15 v36.51,55.56 | 37.15,45.88 37.15,43.97 38.1,43.02 38.1,40.96 40.32,38.73 40.32,32.37 42.55,30.15 R146.2 | R82.1 37.16,45.87 37.15,45.88
  Layer2-Sig 0.152: v41.57,59.75 40.48,58.66 40.48,57.63 38.42,55.56 v36.51,55.56
CPOUT
  Top 0.152: C45.2 52.39,27.78 52.19,27.58 IC12.20
DEBUG-RX
  Top 0.152: R72.2 60.33,42.87 61.59,41.6 61.59,40.01 JP34.3
DEBUG-TX
  Top 0.152: R73.2 59.37,42.87 59.05,42.56 59.05,40.01 JP34.4
  Bottom 0.152: SJ6.1 59.19,39.88 JP34.4
DEBUG_RX  (via drill 0.3)
  Top 0.152: v60.33,46.04 R72.1 | IC13.79 43.44,48.36 43.67,48.59 45.21,48.59 45.83,49.21 v46.83,49.21
  Layer2-Sig 0.152: v60.33,46.04 60.17,45.88 59.21,45.88 58.74,46.35 52.07,46.35 50.32,48.1 47.94,48.1 v46.83,49.21
DEBUG_TX  (via drill 0.3)
  Top 0.152: v59.37,46.51 R73.1 | IC13.78 42.94,48.34 43.5,48.9 44.93,48.9 45.88,49.85 v46.35,49.85
  Layer2-Sig 0.152: v59.37,46.51 59.21,46.67 52.18,46.67 50.43,48.42 48.5,48.42 47.07,49.85 v46.35,49.85
ENC1A  (via drill 0.3)
  Top 0.152: R114.1 81.6,81.92 81.44,82.07 81.12,82.07 80.96,81.92 D16.3 TP26.P$1 | IC13.59 43.56,57.24 v43.97,56.83
  Layer2-Sig 0.152: TP26.P$1 73.82,81.92 69.71,77.8 59.39,77.8 57.78,76.2 57.78,65.41 55.56,63.18 55.56,60.17 54.29,58.9 43.81,58.9 43.5,58.58 43.5,57.31 v43.97,56.83
ENC1B  (via drill 0.3)
  Top 0.152: R115.1 D17.3 TP27.P$1 | IC13.60 43.11,56.74 v43.18,56.67
  Layer2-Sig 0.152: TP27.P$1 69.53,78.11 59.05,78.11 57.47,76.52 57.47,65.56 55.24,63.34 55.24,60.33 54.13,59.21 43.66,59.21 43.02,58.58 43.02,56.83 v43.18,56.67
ENC2A  (via drill 0.3)
  Top 0.152: R116.1 83.19,80.01 D18.3 TP28.P$1 | IC13.23 54.85,60.24 54.61,60.48 54.61,61.59 55.09,62.07 v56.2,62.07
  Layer2-Sig 0.152: v56.2,62.07 56.2,63.34 58.1,65.25 58.1,75.88 59.72,77.5 69.88,77.5 72.39,80.01 TP28.P$1
ENC2B  (via drill 0.3)
  Top 0.152: TP29.P$1 D19.3 R117.1 | IC13.24 56.62,60.74 v56.67,60.8
  Layer2-Sig 0.152: v56.67,60.8 56.83,60.96 56.83,63.5 58.42,65.09 58.42,75.56 60.01,77.15 70.01,77.15 70.96,78.11 TP29.P$1
ENC3A  (via drill 0.3)
  Top 0.152: TP40.P$1 D22.3 R120.1 | IC13.77 42.44,42.81 43.02,42.23 43.02,37.15 42.55,36.67 v42.55,31.75
  Layer2-Sig 0.152: v42.55,31.75 43.97,31.75 45.09,30.64 53.66,30.64 TP40.P$1
ENC3B-SWO  (via drill 0.3)
  Top 0.152: R69.2 v49.05,42.55
  Layer2-Sig 0.152: v49.05,42.55 v54.13,42.55
  Bottom 0.152: SJ6.3 54.74,42.67 54.61,42.55 v54.13,42.55
ENC3B/SWO  (via drill 0.3)
  Top 0.152: TP41.P$1 D23.3 R121.1 | v47.94,29.84 47.94,30.8 48.26,31.11 48.26,33.66 48.42,33.81 48.42,45.4 | 48.42,45.4 48.42,46.51 48.44,46.54 IC13.89 | R69.1 49.05,45.09 48.74,45.4 48.42,45.4
  Layer2-Sig 0.152: TP41.P$1 58.1,23.18 57.12,24.16 57.12,25.75 53.02,29.84 v47.94,29.84
ENC4A  (via drill 0.3)
  Top 0.152: R122.1 D24.3 TP42.P$1 | IC13.90 48.94,45.83 50.64,44.13 50.64,35.56 48.58,33.5 48.58,29.37 v48.42,29.21
  Layer2-Sig 0.152: v48.42,29.21 53.18,29.21 56.82,25.57 56.82,23.67 TP42.P$1
ENC4B  (via drill 0.3)
  Top 0.152: R123.1 D25.3 TP43.P$1 | IC13.91 49.44,46.67 49.34,46.56 49.34,45.91 50.96,44.29 50.96,35.4 48.9,33.34 48.9,29.53 49.05,29.37 v49.05,28.57
  Layer2-Sig 0.152: TP43.P$1 56.52,22.07 56.52,25.4 53.34,28.57 v49.05,28.57
ENC12_PWR
  Top 0.813: D15.A 79.43,76.36 79.15,76.08 SJ8.2
ENC12PWR  (via drill 0.6)
  Top 0.813: D15.C 83.98,76.36 v85.09,77.47
  Bottom 0.813: v85.09,77.47 85.09,78.09 86.06,79.06 88.27,79.06 88.76,79.06 | 88.76,79.06 93.17,79.06 P2.5 | 88.76,79.06 P1.5 88.78,83.82 90.18,85.22 92.2,85.22 TP21.P$1
ENC34_PWR
  Top 0.813: 83.19,27.74 D20.A
  Top 1.016: SJ9.2 83.19,27.88 83.19,27.74
ENC34PWR
  Top 0.813: D20.C TP32.P$1
  Bottom 0.813: TP32.P$1 88.27,20.95 88.76,20.95 | 88.76,20.95 92.22,20.95 P4.5 | P3.5 88.76,20.95
ENC_1A
  Top 0.152: P1.4 89.65,84.93 86.36,84.93 85.69,84.26 85.69,82.84 84.77,81.92 R114.2 R158.2
ENC_1B
  Top 0.152: P1.3 91.33,85.25 86.2,85.25 84.77,83.82 R115.2 R159.1
ENC_2A
  Top 0.152: P2.4 90.22,80.01 R116.2 R160.2
ENC_2B
  Top 0.152: P2.3 88.69,79.53 86.04,79.53 84.61,78.11 R117.2 R161.1
ENC_3A  (via drill 0.3)
  Top 0.152: v69.37,25.08 R120.2 R162.2
  Layer2-Sig 0.152: P3.4 89.63,23.64 70.18,23.64 69.37,24.45 v69.37,25.08
ENC_3B  (via drill 0.3)
  Top 0.152: v69.37,23.18 R121.2 R163.1
  Layer2-Sig 0.152: P3.3 91.33,23.34 69.53,23.34 v69.37,23.18
ENC_4A  (via drill 0.3)
  Top 0.152: v69.37,21.27 R122.2 R164.2
  Layer2-Sig 0.152: v69.37,21.27 69.85,20.8 71.12,20.8 72.07,19.84 91.33,19.84 P4.4
ENC_4B  (via drill 0.3)
  Top 0.152: R123.2 v69.37,19.37 | R165.1 v69.37,16.51
  Layer2-Sig 0.152: P4.3 89.65,19.53 72.07,19.53 71.12,18.57 70.17,18.57 v69.37,19.37 68.74,18.73 68.74,17.14 v69.37,16.51
ESP-I2C-PWR
  Top 0.152: JP7.1 35.4,9.84 37.78,12.22 37.78,18.26 31.27,24.77 31.27,27.39 31.83,27.94 34.61,27.94 | R43.2 42.23,27.78 42.07,27.94 38.42,27.94 | 34.61,27.94 38.42,27.94 | R38.2 38.42,27.94 | R25.2 34.61,27.94
  Top 1.016: JP14.1 34.99,6.35 33.82,5.17 SJ2.2
  pour Layer2-Sig (rank 2): 34.13,5.71 34.13,9.53 34.77,10.16 51.28,10.16 51.91,9.53 51.91,5.71 51.28,5.08 34.77,5.08
ESP-I2C-SCL  (via drill 0.3)
  Top 0.152: JP28.3 JP22.3 39.21,5.08 39.21,9.53 38.1,10.64 38.1,18.41 33.66,22.86 Q5.2 33.66,25.87 33.64,25.89 R24.1 33.64,27.14 v33.66,27.15 | JP58.3 23.34,50.16 20.16,46.99 20.16,25.08 18.73,23.65 v18.73,21.43 R29.2
  Layer2-Sig 0.152: v33.66,27.15 22.23,27.15 18.73,23.65 v18.73,21.43
ESP-I2C-SCL-VSEL
  Top 0.152: JP14.3 JP7.3 38.42,10.95 38.42,18.57 34.62,22.38 34.61,22.38 Q5.3 R25.1
ESP-I2C-SDA  (via drill 0.3)
  Top 0.152: JP28.4 JP22.4 41.75,5.08 41.75,9.53 40.32,10.95 40.32,19.22 37.47,22.07 Q6.2 37.47,25.87 37.45,25.89 R37.1 37.45,27.14 v37.47,27.15 | JP58.1 24.77,46.83 23.02,45.09 v23.02,28.1 23.02,23.01 21.59,21.58 R41.2
  Layer2-Sig 0.152: v37.47,27.15 36.51,28.1 v23.02,28.1
ESP-I2C-SDA-VSEL
  Top 0.152: JP14.4 JP7.4 40.64,11.27 40.64,19.33 38.42,21.55 Q6.3 R38.1
ESP-SPI-!CS1
  Top 0.152: R34.2 63.82,8.89 64.29,8.41 66.52,8.41 68.42,6.51 JP8.6
ESP-SPI-!CS2
  Top 0.152: R46.2 62.87,8.57 63.34,8.1 66.36,8.1 67.31,7.14 67.31,4.92 JP15.6
ESP-SPI-!CS3
  Top 0.152: R54.2 61.91,9.03 63.18,7.76 66.21,7.76 66.99,6.99 66.99,2.7 JP21.6
ESP-SPI-MISO
  Top 0.152: JP21.4 JP15.4 JP8.4 61.91,7.78 59.21,7.78 58.58,8.41 R30.2